# Altium project trusted_io_evt2.PrjPcb (part 1 of 2)
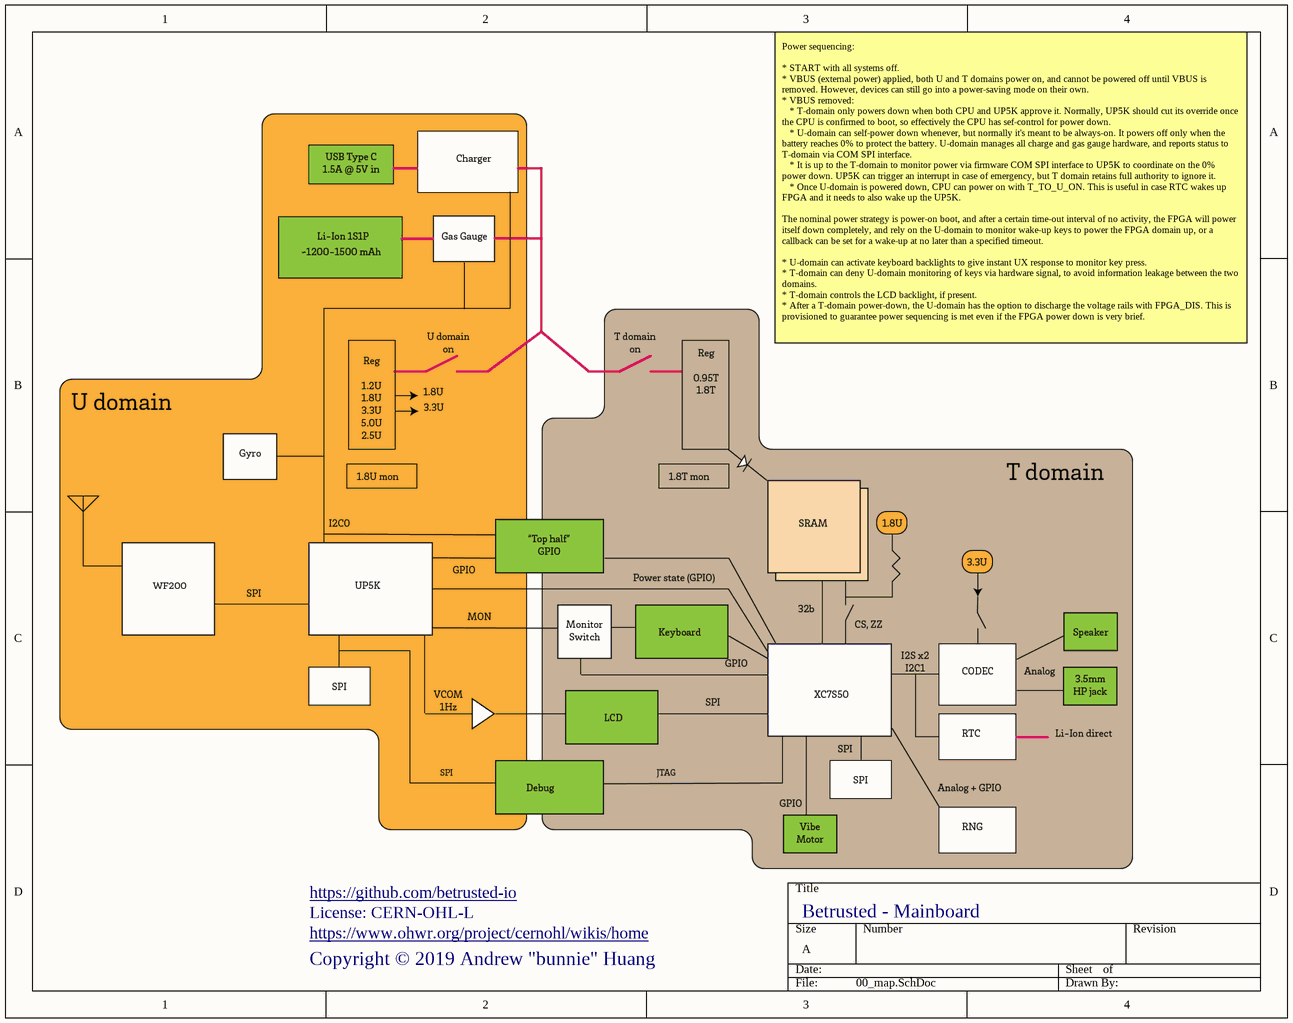
[diagram p0: 00_map.SchDoc]
7 sheets, 359 parts. Net scope: global (net labels, ports and power ports of the same name join across sheets).
Board file: betrusted_evt2b.PcbDoc
Sheets:
  00_map.SchDoc
  01_fpga.SchDoc
  02_memory.SchDoc
  03_power.SchDoc
  04_io.SchDoc
  05_kbd_pm.SchDoc
  07_ux.SchDoc

## Sheet 00_map.SchDoc
size A

### Notes on the sheet
- Power sequencing:
  * START with all systems off.
  * VBUS (external power) applied, both U and T domains power on, and cannot be powered off until VBUS is removed. However, devices can still go into a power-saving mode on their own.
  * VBUS removed:
  * T-domain only powers down when both CPU and UP5K approve it. Normally, UP5K should cut its override once the CPU is confirmed to boot, so effectively the CPU has sef-control for power down.
  * U-domain can self-power down whenever, but normally it's meant to be always-on. It powers off only when the battery reaches 0% to protect the battery. U-domain manages all charge and gas gauge hardware, and reports status to T-domain via COM SPI interface.
  * It is up to the T-domain to monitor power via firmware COM SPI interface to UP5K to coordinate on the 0% power down. UP5K can trigger an interrupt in case of emergency, but T domain retains full authority to ignore it.
  * Once U-domain is powered down, CPU can power on with T_TO_U_ON. This is useful in case RTC wakes up FPGA and it needs to also wake up the UP5K.
  The nominal power strategy is power-on boot, and after a certain time-out interval of no activity, the FPGA will power itself down completely, and rely on the U-domain to monitor wake-up keys to power the FPGA domain up, or a callback can be set for a wake-up at no later than a specified timeout.
  * U-domain can activate keyboard backlights to give instant UX response to monitor key press.
  * T-domain can deny U-domain monitoring of keys via hardware signal, to avoid information leakage between the two domains.
  * T-domain controls the LCD backlight, if present.
  * After a T-domain power-down, the U-domain has the option to discharge the voltage rails with FPGA_DIS. This is provisioned to guarantee power sequencing is met even if the FPGA power down is very brief.
- https://github.com/betrusted-io
- License: CERN-OHL-L
- Copyright © 2019 Andrew "bunnie" Huang
- https://www.ohwr.org/project/cernohl/wikis/home
- Betrusted - Mainboard

## Sheet 01_fpga.SchDoc
size C; VENDOR: TI; MPN: SN74AUC1G66YZPR; MYPN: U-SN74AUC1G66YZPR
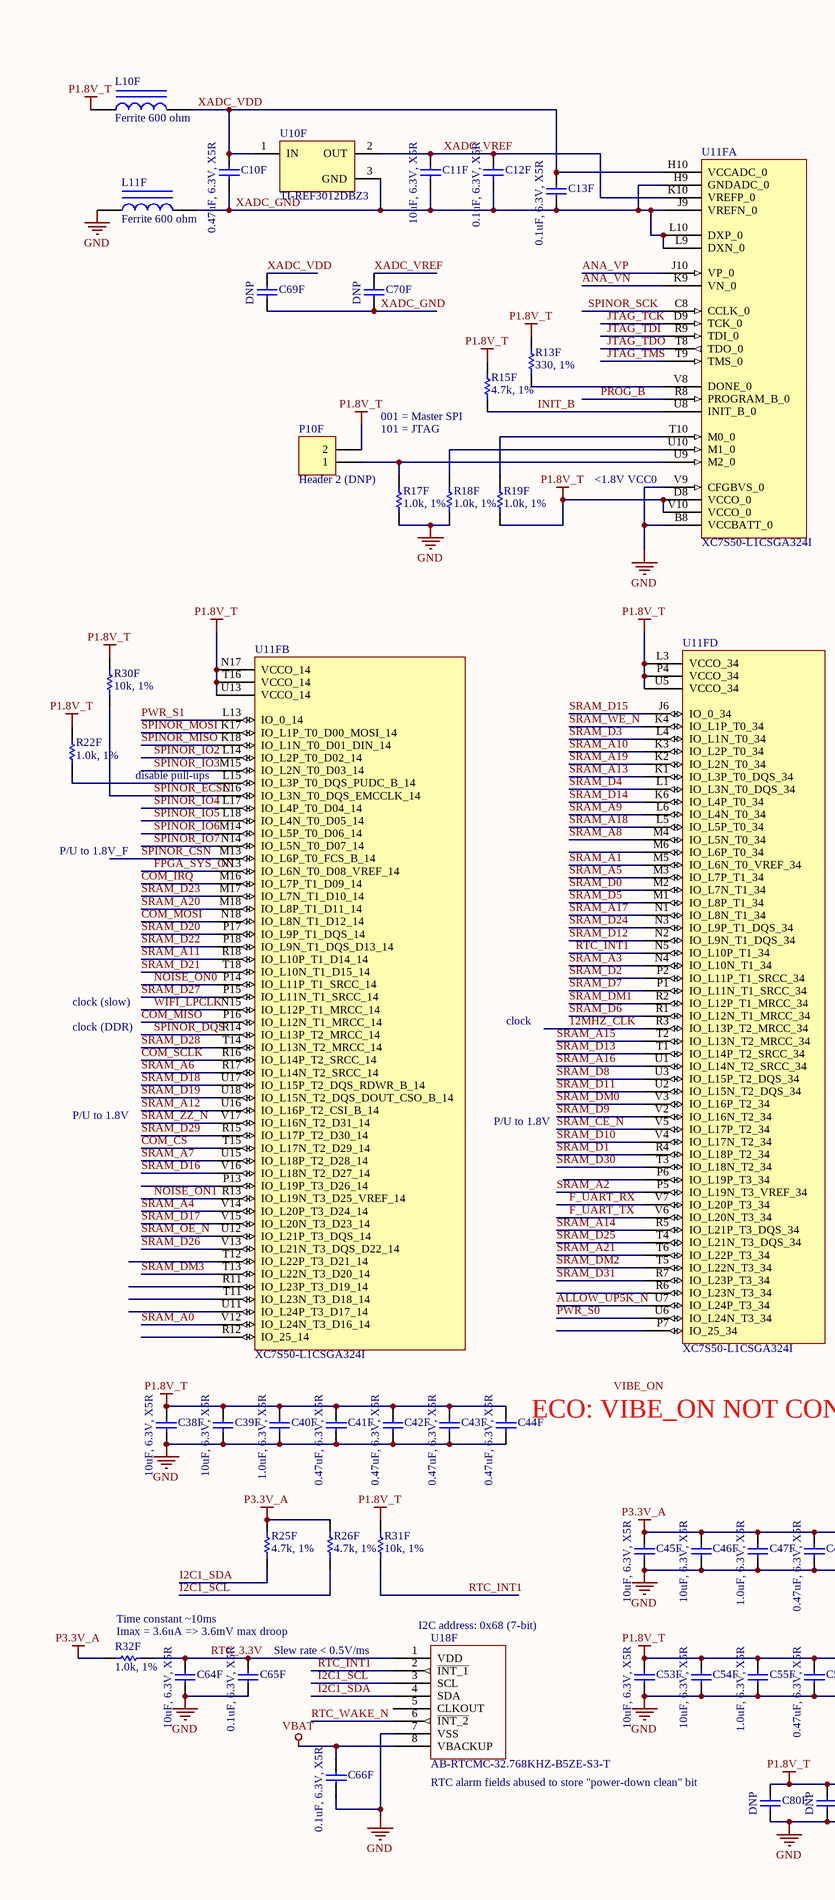
[diagram p1: 01_fpga.SchDoc, left]
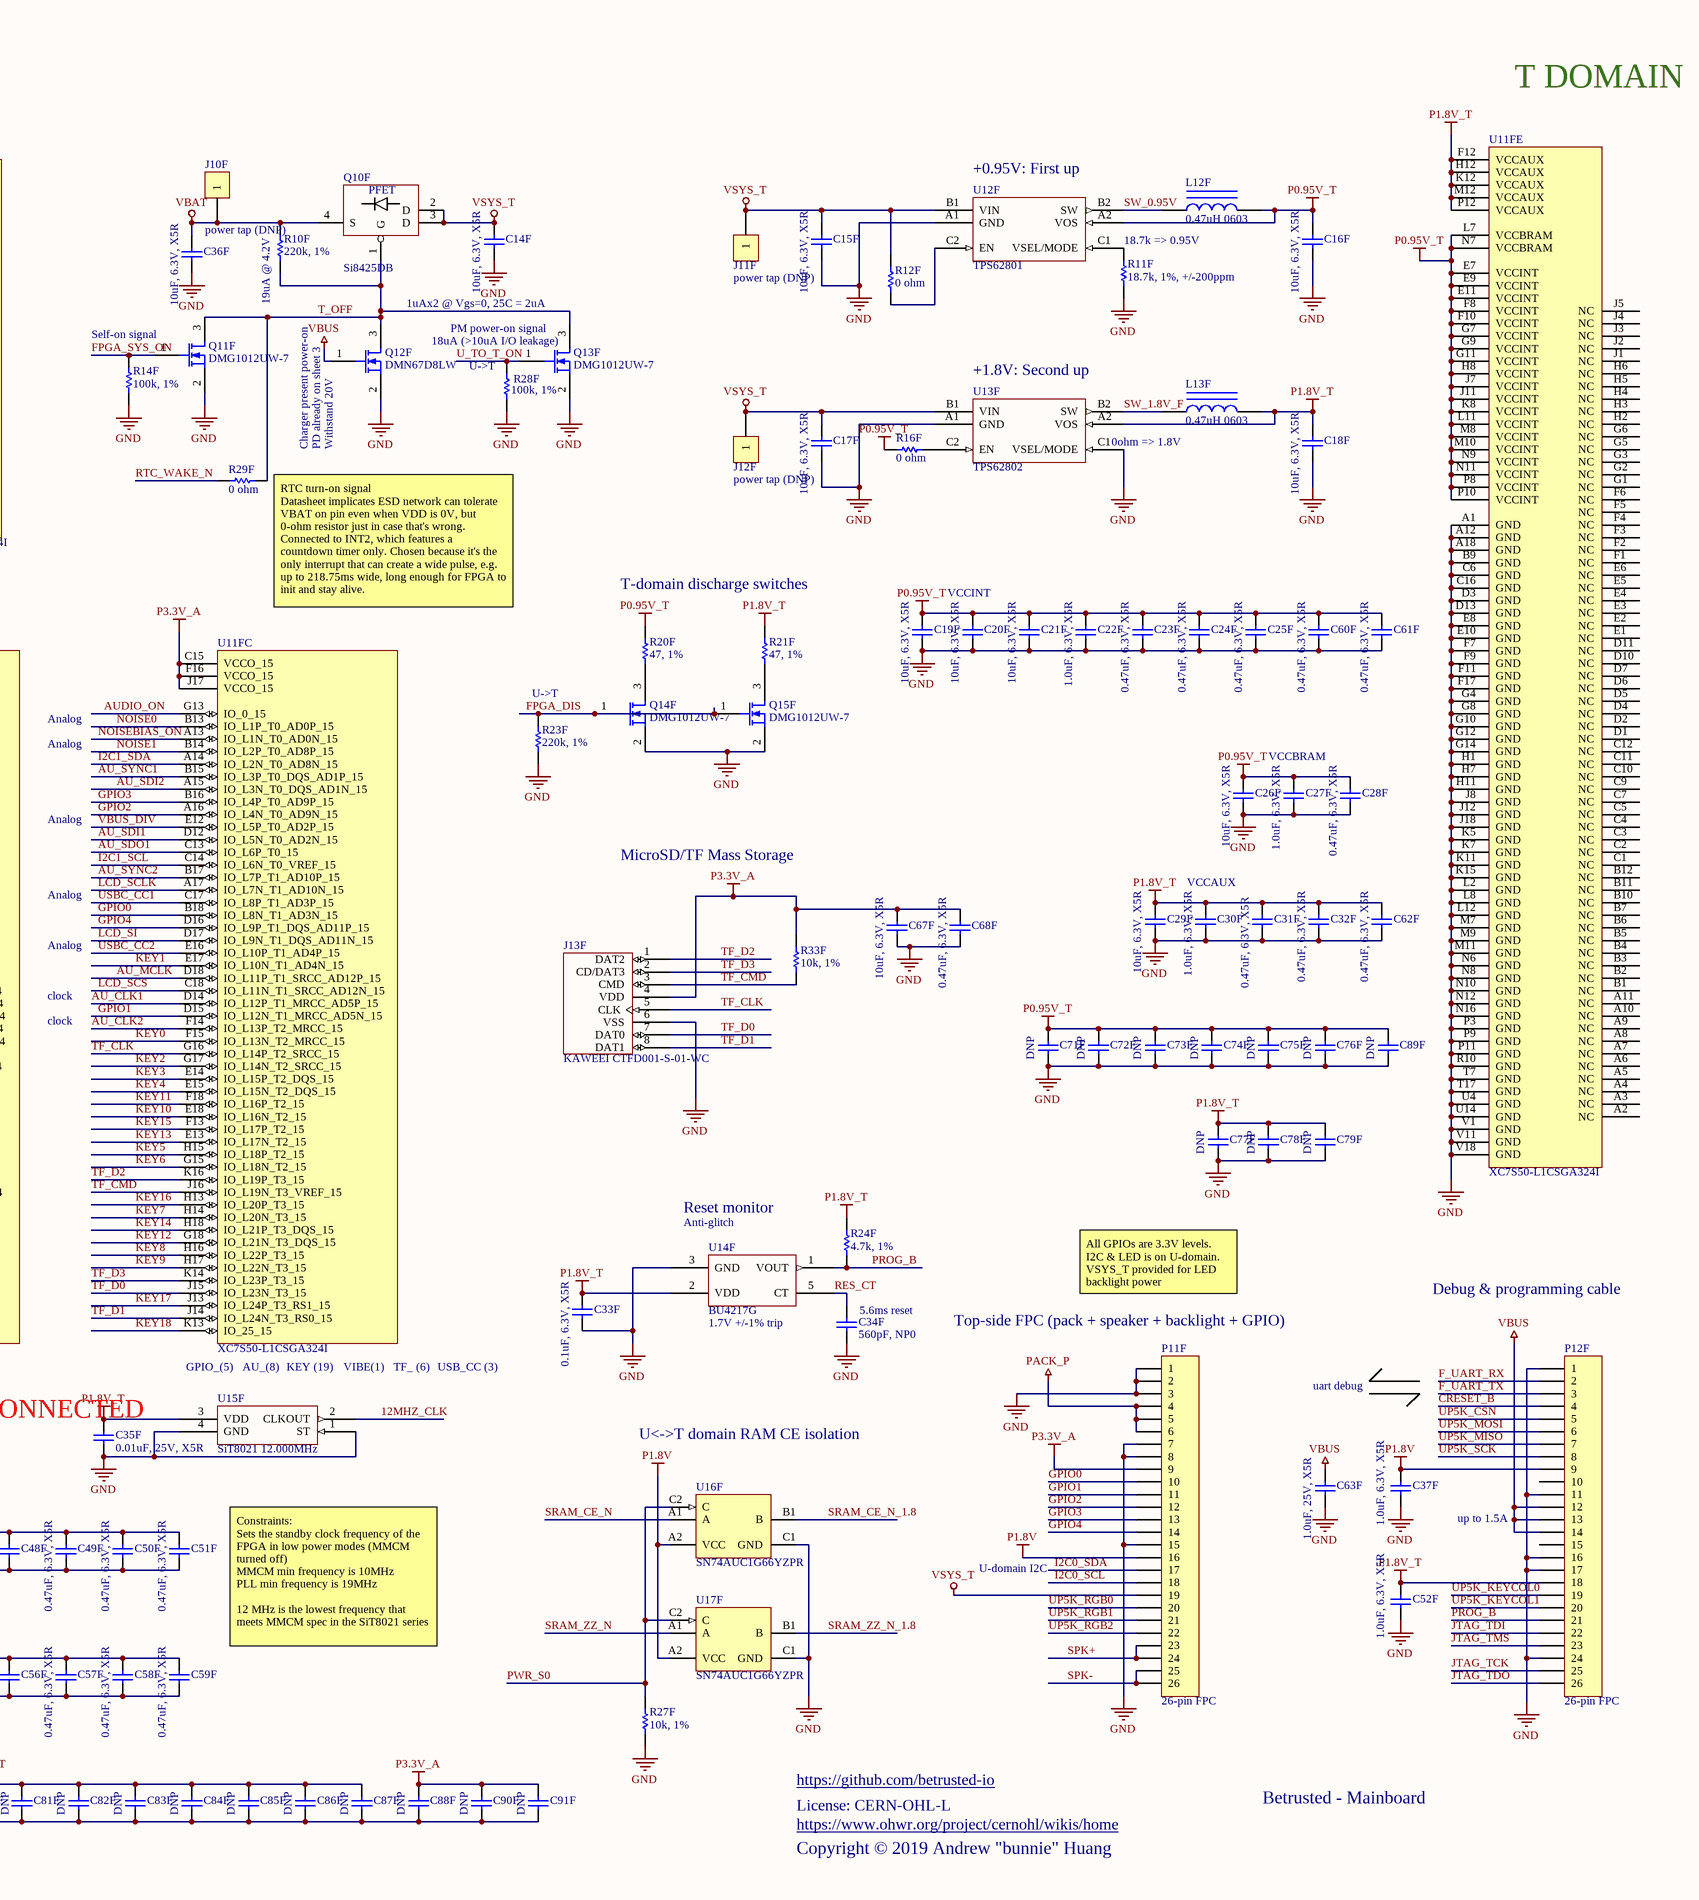
[diagram p2: 01_fpga.SchDoc, right]

### Parts
C10F  0.47uF, 6.3V, X5R  [B_CAP0201]
C11F  10uF, 6.3V, X5R  [B_CAP0603]
C12F  0.1uF, 6.3V, X5R  [B_CAP0201]
C13F  0.1uF, 6.3V, X5R  [B_CAP0201]
C14F  10uF, 6.3V, X5R  [B_CAP0603]
C15F  10uF, 6.3V, X5R  [B_CAP0603]
C16F  10uF, 6.3V, X5R  [B_CAP0603]
C17F  10uF, 6.3V, X5R  [B_CAP0603]
C18F  10uF, 6.3V, X5R  [B_CAP0603]
C19F  10uF, 6.3V, X5R  [B_CAP0603]
C20F  10uF, 6.3V, X5R  [B_CAP0603]
C21F  10uF, 6.3V, X5R  [B_CAP0603]
C22F  1.0uF, 6.3V, X5R  [B_CAP0201]
C23F  0.47uF, 6.3V, X5R  [B_CAP0201]
C24F  0.47uF, 6.3V, X5R  [B_CAP0201]
C25F  0.47uF, 6.3V, X5R  [B_CAP0201]
C26F  10uF, 6.3V, X5R  [B_CAP0603]
C27F  1.0uF, 6.3V, X5R  [B_CAP0201]
C28F  0.47uF, 6.3V, X5R  [B_CAP0201]
C29F  10uF, 6.3V, X5R  [B_CAP0603]
C30F  1.0uF, 6.3V, X5R  [B_CAP0201]
C31F  0.47uF, 6.3V, X5R  [B_CAP0201]
C32F  0.47uF, 6.3V, X5R  [B_CAP0201]
C33F  0.1uF, 6.3V, X5R  [B_CAP0201]
C34F  560pF, NP0  [B_RES0201]
C35F  0.01uF, 25V, X5R  [B_RES0201]
C36F  10uF, 6.3V, X5R  [B_CAP0603]
C37F  1.0uF, 6.3V, X5R  [B_CAP0201]
C38F  10uF, 6.3V, X5R  [B_CAP0603]
C39F  10uF, 6.3V, X5R  [B_CAP0603]
C40F  1.0uF, 6.3V, X5R  [B_CAP0201]
C41F  0.47uF, 6.3V, X5R  [B_CAP0201]
C42F  0.47uF, 6.3V, X5R  [B_CAP0201]
C43F  0.47uF, 6.3V, X5R  [B_CAP0201]
C44F  0.47uF, 6.3V, X5R  [B_CAP0201]
C45F  10uF, 6.3V, X5R  [B_CAP0603]
C46F  10uF, 6.3V, X5R  [B_CAP0603]
C47F  1.0uF, 6.3V, X5R  [B_CAP0201]
C48F  0.47uF, 6.3V, X5R  [B_CAP0201]
C49F  0.47uF, 6.3V, X5R  [B_CAP0201]
C50F  0.47uF, 6.3V, X5R  [B_CAP0201]
C51F  0.47uF, 6.3V, X5R  [B_CAP0201]
C52F  1.0uF, 6.3V, X5R  [B_CAP0201]
C53F  10uF, 6.3V, X5R  [B_CAP0603]
C54F  10uF, 6.3V, X5R  [B_CAP0603]
C55F  1.0uF, 6.3V, X5R  [B_CAP0201]
C56F  0.47uF, 6.3V, X5R  [B_CAP0201]
C57F  0.47uF, 6.3V, X5R  [B_CAP0201]
C58F  0.47uF, 6.3V, X5R  [B_CAP0201]
C59F  0.47uF, 6.3V, X5R  [B_CAP0201]
C60F  0.47uF, 6.3V, X5R  [B_CAP0201]
C61F  0.47uF, 6.3V, X5R  [B_CAP0201]
C62F  0.47uF, 6.3V, X5R  [B_CAP0201]
C63F  1.0uF, 25V, X5R  [B_CAP0603]
C64F  10uF, 6.3V, X5R  [B_CAP0603]
C65F  0.1uF, 6.3V, X5R  [B_CAP0201]
C66F  0.1uF, 6.3V, X5R  [B_CAP0201]
C67F  10uF, 6.3V, X5R  [B_CAP0603]
C68F  0.47uF, 6.3V, X5R  [B_CAP0201]
C69F  DNP  [B_CAP0201]
C70F  DNP  [B_CAP0201]
C71F  DNP  [B_CAP0201]
C72F  DNP  [B_CAP0201]
C73F  DNP  [B_CAP0201]
C74F  DNP  [B_CAP0201]
C75F  DNP  [B_CAP0201]
C76F  DNP  [B_CAP0201]
C77F  DNP  [B_CAP0201]
C78F  DNP  [B_CAP0201]
C79F  DNP  [B_CAP0201]
C80F  DNP  [B_CAP0201]
C81F  DNP  [B_CAP0201]
C82F  DNP  [B_CAP0201]
C83F  DNP  [B_CAP0201]
C84F  DNP  [B_CAP0201]
C85F  DNP  [B_CAP0201]
C86F  DNP  [B_CAP0201]
C87F  DNP  [B_CAP0201]
C88F  DNP  [B_CAP0201]
C89F  DNP  [B_CAP0201]
C90F  DNP  [B_CAP0201]
C91F  DNP  [B_CAP0201]
J10F  power tap (DNP)  [RESTAP-0603]
J11F  power tap (DNP)  [RESTAP-0603]
J12F  power tap (DNP)  [RESTAP-0603]
J13F  KAWEEI CTFD001-S-01-WC  [AUK_TFC08W01-HC-H]
L10F  Ferrite 600 ohm  [B_IND0603]
L11F  Ferrite 600 ohm  [B_IND0603]
L12F  0.47uH 0603  [B_IND0603]
L13F  0.47uH 0603  [B_IND0603]
P10F  Header 2 (DNP)  [HDR1X2]
P11F  26-pin FPC  [HRS_FH34SRJ-26S-0.5SH(50)]
P12F  26-pin FPC  [HRS_FH34SRJ-26S-0.5SH(50)]
Q10F  Si8425DB  [VISHAY_MICRO_FOOT_4_BUMP]
Q11F  DMG1012UW-7  [SOT323-3AN]
Q12F  DMN67D8LW  [SOT323-3AN]
Q13F  DMG1012UW-7  [SOT323-3AN]
Q14F  DMG1012UW-7  [SOT323-3AN]
Q15F  DMG1012UW-7  [SOT323-3AN]
R10F  220k, 1%  [B_RES0201]
R11F  18.7k, 1%, +/-200ppm  [B_RES0402]
R12F  0 ohm  [B_RES0201]
R13F  330, 1%  [B_RES0201]
R14F  100k, 1%  [B_RES0201]
R15F  4.7k, 1%  [B_RES0201]
R16F  0 ohm  [B_RES0201]
R17F  1.0k, 1%  [B_RES0201]
R18F  1.0k, 1%  [B_RES0201]
R19F  1.0k, 1%  [B_RES0201]
R20F  47, 1%  [B_RES0402]
R21F  47, 1%  [B_RES0402]
R22F  1.0k, 1%  [B_RES0201]
R23F  220k, 1%  [B_RES0201]
R24F  4.7k, 1%  [B_RES0201]
R25F  4.7k, 1%  [B_RES0201]
R26F  4.7k, 1%  [B_RES0201]
R27F  10k, 1%  [B_RES0201]
R28F  100k, 1%  [B_RES0201]
R29F  0 ohm  [B_RES0201]
R30F  10k, 1%  [B_RES0201]
R31F  10k, 1%  [B_RES0201]
R32F  1.0k, 1%  [B_RES0201]
R33F  10k, 1%  [B_RES0201]
U10F  TI-REF3012DBZ3  [ONSC-SOT-23-3-318-08_V]
U11F  XC7S50-L1CSGA324I  [BGA324C80P18X18_1500X1500X150]  (parts A,B,C,D,E of 5)
U12F  TPS62801  [BGA6C35P2X3_70X105X40_NSMD]
U13F  TPS62802  [BGA6C35P2X3_70X105X40_NSMD]
U14F  BU4217G  [SOT23-5AN]
U15F  SiT8021 12.000MHz  [SiTIME_CSP]
U16F  SN74AUC1G66YZPR  [YZP0005ADAD]
U17F  SN74AUC1G66YZPR  [YZP0005ADAD]
U18F  AB-RTCMC-32.768KHZ-B5ZE-S3-T  [ABRACON_RTCMC_LGA10]

### Nets
GND: C14F.2 C15F.2 C16F.2 C17F.2 C18F.2 C19F.2 C20F.2 C21F.2 C22F.1 C23F.2 C24F.2 C25F.2 C26F.2 C27F.1 C28F.2 C29F.2 C30F.1 C31F.2 C32F.2 C33F.2 C34F.2 C35F.2 C36F.2 C37F.1 C38F.2 C39F.2 C40F.1 C41F.2 C42F.2 C43F.2 C44F.2 C45F.2 C46F.2 C47F.1 C48F.2 C49F.2 C50F.2 C51F.2 C52F.1 C53F.2 C54F.2 C55F.1 C56F.2 C57F.2 C58F.2 C59F.2 C60F.2 C61F.2 C62F.2 C63F.2 C64F.2 C65F.2 C66F.2 C67F.2 C68F.2 C71F.2 C72F.2 C73F.2 C74F.2 C75F.2 C76F.2 C77F.2 C78F.2 C79F.2 C80F.2 C81F.2 C82F.2 C83F.2 C84F.2 C85F.2 C86F.2 C87F.2 C88F.2 C89F.2 C90F.2 C91F.2 J13F.6(VSS) L11F.1 P11F.1 P11F.2 P11F.3 P11F.7 P11F.8 P11F.15 P12F.1 P12F.11 P12F.16 P12F.17 P12F.24 Q11F.2(S) Q12F.2(S) Q13F.2(S) Q14F.2(S) Q15F.2(S) R11F.2 R14F.1 R17F.1 R18F.1 R23F.1 R27F.2 R28F.1 U11F.A1(GND) U11F.A12(GND) U11F.A18(GND) U11F.B8(VCCBATT_0) U11F.B9(GND) U11F.C6(GND) U11F.C16(GND) U11F.D3(GND) U11F.D13(GND) U11F.E8(GND) U11F.E10(GND) U11F.F7(GND) U11F.F9(GND) U11F.F11(GND) U11F.F17(GND) U11F.G4(GND) U11F.G8(GND) U11F.G10(GND) U11F.G12(GND) U11F.G14(GND) U11F.H1(GND) U11F.H7(GND) U11F.H11(GND) U11F.J8(GND) U11F.J12(GND) U11F.J18(GND) U11F.K5(GND) U11F.K7(GND) U11F.K11(GND) U11F.K15(GND) U11F.L2(GND) U11F.L8(GND) U11F.L12(GND) U11F.M7(GND) U11F.M9(GND) U11F.M11(GND) U11F.N6(GND) U11F.N8(GND) U11F.N10(GND) U11F.N12(GND) U11F.N16(GND) U11F.P3(GND) U11F.P9(GND) U11F.P11(GND) U11F.R10(GND) U11F.T7(GND) U11F.T17(GND) U11F.U4(GND) U11F.U14(GND) U11F.V1(GND) U11F.V9(CFGBVS_0) U11F.V11(GND) U11F.V18(GND) U12F.A1(GND) U13F.A1(GND) U13F.C1(VSEL/MODE) U14F.3(GND) U15F.1(ST) U15F.4(GND) U16F.C1(GND) U17F.C1(GND) U18F.7(VSS)
P0.95V_T: C16F.1 C19F.1 C20F.1 C21F.1 C22F.2 C23F.1 C24F.1 C25F.1 C26F.1 C27F.2 C28F.1 C60F.1 C61F.1 C71F.1 C72F.1 C73F.1 C74F.1 C75F.1 C76F.1 C89F.1 L12F.2 R16F.1 R20F.2 U11F.E7(VCCINT) U11F.E9(VCCINT) U11F.E11(VCCINT) U11F.F8(VCCINT) U11F.F10(VCCINT) U11F.G7(VCCINT) U11F.G9(VCCINT) U11F.G11(VCCINT) U11F.H8(VCCINT) U11F.J7(VCCINT) U11F.J11(VCCINT) U11F.K8(VCCINT) U11F.L7(VCCBRAM) U11F.L11(VCCINT) U11F.M8(VCCINT) U11F.M10(VCCINT) U11F.N7(VCCBRAM) U11F.N9(VCCINT) U11F.N11(VCCINT) U11F.P8(VCCINT) U11F.P10(VCCINT) U12F.A2(VOS)
P1.8V: C37F.2 P11F.16 P12F.9 U16F.A2(VCC) U17F.A2(VCC)
P1.8V_T: C18F.1 C29F.1 C30F.2 C31F.1 C32F.1 C33F.1 C35F.1 C38F.1 C39F.1 C40F.2 C41F.1 C42F.1 C43F.1 C44F.1 C52F.2 C53F.1 C54F.1 C55F.2 C56F.1 C57F.1 C58F.1 C59F.1 C62F.1 C77F.1 C78F.1 C79F.1 C80F.1 C81F.1 C82F.1 C83F.1 C84F.1 C85F.1 C86F.1 C87F.1 L10F.1 L13F.2 P10F.2 P12F.18 R13F.2 R15F.2 R19F.1 R21F.2 R22F.2 R24F.2 R30F.1 R31F.1 U11F.D8(VCCO_0) U11F.F12(VCCAUX) U11F.H12(VCCAUX) U11F.K12(VCCAUX) U11F.L3(VCCO_34) U11F.M12(VCCAUX) U11F.N17(VCCO_14) U11F.P4(VCCO_34) U11F.P12(VCCAUX) U11F.T16(VCCO_14) U11F.U5(VCCO_34) U11F.U13(VCCO_14) U11F.V10(VCCO_0) U13F.A2(VOS) U14F.2(VDD) U15F.3(VDD)
P3.3V_A: C45F.1 C46F.1 C47F.2 C48F.1 C49F.1 C50F.1 C51F.1 C67F.1 C68F.1 C88F.1 C90F.1 C91F.1 J13F.4(VDD) P11F.9 R25F.2 R26F.2 R32F.2 R33F.1 U11F.C15(VCCO_15) U11F.F16(VCCO_15) U11F.J17(VCCO_15)
PACK_P: P11F.4 P11F.5 P11F.6
VBAT: C36F.1 C66F.1 J10F.1 Q10F.4(S) R10F.2 U18F.8(VBACKUP)
VBUS: C63F.1 P12F.12 P12F.13 P12F.14 Q12F.1(G)
VSYS_T: C14F.1 C15F.1 C17F.1 J11F.1 J12F.1 P11F.19 Q10F.2(D) Q10F.3(D) R12F.2 U12F.B1(VIN) U13F.B1(VIN)
12MHZ_CLK: U11F.R3(IO_L13P_T2_MRCC_34) U15F.2(CLKOUT)
ALLOW_UP5K_N: U11F.U7(IO_L24P_T3_34)
ANA_VN: U11F.K9(VN_0)
ANA_VP: U11F.J10(VP_0)
AU_CLK1: U11F.D14(IO_L12P_T1_MRCC_AD5P_15)
AU_CLK2: U11F.F14(IO_L13P_T2_MRCC_15)
AU_MCLK: U11F.D18(IO_L11P_T1_SRCC_AD12P_15)
AU_SDI1: U11F.D12(IO_L5N_T0_AD2N_15)
AU_SDI2: U11F.A15(IO_L3N_T0_DQS_AD1N_15)
AU_SDO1: U11F.C13(IO_L6P_T0_15)
AU_SYNC1: U11F.B15(IO_L3P_T0_DQS_AD1P_15)
AU_SYNC2: U11F.B17(IO_L7P_T1_AD10P_15)
AUDIO_ON: U11F.G13(IO_0_15)
COM_CS: U11F.T15(IO_L17N_T2_D29_14)
COM_IRQ: U11F.M16(IO_L7P_T1_D09_14)
COM_MISO: U11F.P16(IO_L12N_T1_MRCC_14)
COM_MOSI: U11F.N18(IO_L8N_T1_D12_14)
COM_SCLK: U11F.R16(IO_L14P_T2_SRCC_14)
CRESET_B: P12F.4
F_UART_RX: P12F.2 U11F.V7(IO_L20P_T3_34)
F_UART_TX: P12F.3 U11F.V6(IO_L20N_T3_34)
FPGA_DIS: Q14F.1(G) Q15F.1(G) R23F.2
FPGA_SYS_ON: Q11F.1(G) R14F.2 U11F.N13(IO_L6N_T0_D08_VREF_14)
GPIO0: P11F.10 U11F.B18(IO_L8N_T1_AD3N_15)
GPIO1: P11F.11 U11F.D15(IO_L12N_T1_MRCC_AD5N_15)
GPIO2: P11F.12 U11F.A16(IO_L4N_T0_AD9N_15)
GPIO3: P11F.13 U11F.B16(IO_L4P_T0_AD9P_15)
GPIO4: P11F.14 U11F.D16(IO_L9P_T1_DQS_AD11P_15)
I2C0_SCL: P11F.18
I2C0_SDA: P11F.17
I2C1_SCL: R26F.1 U11F.C14(IO_L6N_T0_VREF_15) U18F.3(SCL)
I2C1_SDA: R25F.1 U11F.A14(IO_L2N_T0_AD8N_15) U18F.4(SDA)
INIT_B: R15F.1 U11F.U8(INIT_B_0)
JTAG_TCK: P12F.25 U11F.D9(TCK_0)
JTAG_TDI: P12F.22 U11F.R9(TDI_0)
JTAG_TDO: P12F.26 U11F.T8(TDO_0)
JTAG_TMS: P12F.23 U11F.T9(TMS_0)
KEY0: U11F.F15(IO_L13N_T2_MRCC_15)
KEY1: U11F.E17(IO_L10N_T1_AD4N_15)
KEY2: U11F.G17(IO_L14N_T2_SRCC_15)
KEY3: U11F.E14(IO_L15P_T2_DQS_15)
KEY4: U11F.E15(IO_L15N_T2_DQS_15)
KEY5: U11F.H15(IO_L18P_T2_15)
KEY6: U11F.G15(IO_L18N_T2_15)
KEY7: U11F.H14(IO_L20N_T3_15)
KEY8: U11F.H16(IO_L22P_T3_15)
KEY9: U11F.H17(IO_L22N_T3_15)
KEY10: U11F.E18(IO_L16N_T2_15)
KEY11: U11F.F18(IO_L16P_T2_15)
KEY12: U11F.G18(IO_L21N_T3_DQS_15)
KEY13: U11F.E13(IO_L17N_T2_15)
KEY14: U11F.H18(IO_L21P_T3_DQS_15)
KEY15: U11F.F13(IO_L17P_T2_15)
KEY16: U11F.H13(IO_L20P_T3_15)
KEY17: U11F.J13(IO_L24P_T3_RS1_15)
KEY18: U11F.K13(IO_25_15)
LCD_SCLK: U11F.A17(IO_L7N_T1_AD10N_15)
LCD_SCS: U11F.C18(IO_L11N_T1_SRCC_AD12N_15)
LCD_SI: U11F.D17(IO_L9N_T1_DQS_AD11N_15)
NOISE0: U11F.B13(IO_L1P_T0_AD0P_15)
NOISE1: U11F.B14(IO_L2P_T0_AD8P_15)
NOISE_ON0: U11F.P14(IO_L11P_T1_SRCC_14)
NOISE_ON1: U11F.R13(IO_L19N_T3_D25_VREF_14)
NOISEBIAS_ON: U11F.A13(IO_L1N_T0_AD0N_15)
PROG_B: P12F.21 R24F.1 U11F.R8(PROGRAM_B_0) U14F.1(VOUT)
PWR_S0: R27F.1 U11F.U6(IO_L24N_T3_34) U16F.C2(C) U17F.C2(C)
PWR_S1: U11F.L13(IO_0_14)
RES_CT: C34F.1 U14F.5(CT)
RTC_3.3V: C64F.1 C65F.1 R32F.1 U18F.1(VDD)
RTC_INT1: R31F.2 U11F.N5(IO_L10P_T1_34) U18F.2(~{INT_1})
RTC_WAKE_N: R29F.1 U18F.6(~{INT_2})
SPINOR_CSN: U11F.M13(IO_L6P_T0_FCS_B_14)
SPINOR_DQS: U11F.R14(IO_L13P_T2_MRCC_14)
SPINOR_ECSN: R30F.2 U11F.L16(IO_L3N_T0_DQS_EMCCLK_14)
SPINOR_IO2: U11F.L14(IO_L2P_T0_D02_14)
SPINOR_IO3: U11F.M15(IO_L2N_T0_D03_14)
SPINOR_IO4: U11F.L17(IO_L4P_T0_D04_14)
SPINOR_IO5: U11F.L18(IO_L4N_T0_D05_14)
SPINOR_IO6: U11F.M14(IO_L5P_T0_D06_14)
SPINOR_IO7: U11F.N14(IO_L5N_T0_D07_14)
SPINOR_MISO: U11F.K18(IO_L1N_T0_D01_DIN_14)
SPINOR_MOSI: U11F.K17(IO_L1P_T0_D00_MOSI_14)
SPINOR_SCK: U11F.C8(CCLK_0)
SPK+: P11F.23 P11F.24
SPK-: P11F.25 P11F.26
SRAM_A0: U11F.V12(IO_L24N_T3_D16_14)
SRAM_A1: U11F.M5(IO_L6N_T0_VREF_34)
SRAM_A2: U11F.P5(IO_L19N_T3_VREF_34)
SRAM_A3: U11F.N4(IO_L10N_T1_34)
SRAM_A4: U11F.V14(IO_L20P_T3_D24_14)
SRAM_A5: U11F.M3(IO_L7P_T1_34)
SRAM_A6: U11F.R17(IO_L14N_T2_SRCC_14)
SRAM_A7: U11F.U15(IO_L18P_T2_D28_14)
SRAM_A8: U11F.M4(IO_L5N_T0_34)
SRAM_A9: U11F.L6(IO_L4N_T0_34)
SRAM_A10: U11F.K3(IO_L2P_T0_34)
SRAM_A11: U11F.R18(IO_L10P_T1_D14_14)
SRAM_A12: U11F.U16(IO_L16P_T2_CSI_B_14)
SRAM_A13: U11F.K1(IO_L3P_T0_DQS_34)
SRAM_A14: U11F.R5(IO_L21P_T3_DQS_34)
SRAM_A15: U11F.T2(IO_L13N_T2_MRCC_34)
SRAM_A16: U11F.U1(IO_L14N_T2_SRCC_34)
SRAM_A17: U11F.N1(IO_L8N_T1_34)
SRAM_A18: U11F.L5(IO_L5P_T0_34)
SRAM_A19: U11F.K2(IO_L2N_T0_34)
SRAM_A20: U11F.M18(IO_L8P_T1_D11_14)
SRAM_A21: U11F.T6(IO_L22P_T3_34)
SRAM_CE_N: U11F.V5(IO_L17P_T2_34) U16F.A1(A)
SRAM_CE_N_1.8: U16F.B1(B)
SRAM_D0: U11F.M2(IO_L7N_T1_34)
SRAM_D1: U11F.R4(IO_L18P_T2_34)
SRAM_D2: U11F.P2(IO_L11P_T1_SRCC_34)
SRAM_D3: U11F.L4(IO_L1N_T0_34)
SRAM_D4: U11F.L1(IO_L3N_T0_DQS_34)
SRAM_D5: U11F.M1(IO_L8P_T1_34)
SRAM_D6: U11F.R1(IO_L12N_T1_MRCC_34)
SRAM_D7: U11F.P1(IO_L11N_T1_SRCC_34)
SRAM_D8: U11F.U3(IO_L15P_T2_DQS_34)
SRAM_D9: U11F.V2(IO_L16N_T2_34)
SRAM_D10: U11F.V4(IO_L17N_T2_34)
SRAM_D11: U11F.U2(IO_L15N_T2_DQS_34)
SRAM_D12: U11F.N2(IO_L9N_T1_DQS_34)
SRAM_D13: U11F.T1(IO_L14P_T2_SRCC_34)
SRAM_D14: U11F.K6(IO_L4P_T0_34)
SRAM_D15: U11F.J6(IO_0_34)
SRAM_D16: U11F.V16(IO_L18N_T2_D27_14)
SRAM_D17: U11F.V15(IO_L20N_T3_D23_14)
SRAM_D18: U11F.U17(IO_L15P_T2_DQS_RDWR_B_14)
SRAM_D19: U11F.U18(IO_L15N_T2_DQS_DOUT_CSO_B_14)
SRAM_D20: U11F.P17(IO_L9P_T1_DQS_14)
SRAM_D21: U11F.T18(IO_L10N_T1_D15_14)
SRAM_D22: U11F.P18(IO_L9N_T1_DQS_D13_14)
SRAM_D23: U11F.M17(IO_L7N_T1_D10_14)
SRAM_D24: U11F.N3(IO_L9P_T1_DQS_34)
SRAM_D25: U11F.T4(IO_L21N_T3_DQS_34)
SRAM_D26: U11F.V13(IO_L21N_T3_DQS_D22_14)
SRAM_D27: U11F.P15(IO_L11N_T1_SRCC_14)
SRAM_D28: U11F.T14(IO_L13N_T2_MRCC_14)
SRAM_D29: U11F.R15(IO_L17P_T2_D30_14)
SRAM_D30: U11F.T3(IO_L18N_T2_34)
SRAM_D31: U11F.R7(IO_L23P_T3_34)
SRAM_DM0: U11F.V3(IO_L16P_T2_34)
SRAM_DM1: U11F.R2(IO_L12P_T1_MRCC_34)
SRAM_DM2: U11F.T5(IO_L22N_T3_34)
SRAM_DM3: U11F.T13(IO_L22N_T3_D20_14)
SRAM_OE_N: U11F.U12(IO_L21P_T3_DQS_14)
SRAM_WE_N: U11F.K4(IO_L1P_T0_34)
SRAM_ZZ_N: U11F.V17(IO_L16N_T2_D31_14) U17F.A1(A)
SRAM_ZZ_N_1.8: U17F.B1(B)
SW_0.95V: L12F.1 U12F.B2(SW)
SW_1.8V_F: L13F.1 U13F.B2(SW)
T_OFF: Q10F.1(G) Q11F.3(D) Q12F.3(D) Q13F.3(D) R10F.1 R29F.2
TF_CLK: J13F.5(CLK) U11F.G16(IO_L14P_T2_SRCC_15)
TF_CMD: J13F.3(CMD) R33F.2 U11F.J16(IO_L19N_T3_VREF_15)
TF_D0: J13F.7(DAT0) U11F.J15(IO_L23N_T3_15)
TF_D1: J13F.8(DAT1) U11F.J14(IO_L24N_T3_RS0_15)
TF_D2: J13F.1(DAT2) U11F.K16(IO_L19P_T3_15)
TF_D3: J13F.2(CD/DAT3) U11F.K14(IO_L23P_T3_15)
U_TO_T_ON: Q13F.1(G) R28F.2
UP5K_CSN: P12F.5
UP5K_KEYCOL0: P12F.19
UP5K_KEYCOL1: P12F.20
UP5K_MISO: P12F.7
UP5K_MOSI: P12F.6
UP5K_RGB0: P11F.20
UP5K_RGB1: P11F.21
UP5K_RGB2: P11F.22
UP5K_SCK: P12F.8
USBC_CC1: U11F.C17(IO_L8P_T1_AD3P_15)
USBC_CC2: U11F.E16(IO_L10P_T1_AD4P_15)
VBUS_DIV: U11F.E12(IO_L5P_T0_AD2P_15)
WIFI_LPCLK: U11F.N15(IO_L12P_T1_MRCC_14)
XADC_GND: C10F.2 C11F.2 C12F.2 C13F.2 C69F.2 C70F.2 L11F.2 U10F.3(GND) U11F.H9(GNDADC_0) U11F.J9(VREFN_0) U11F.L9(DXN_0) U11F.L10(DXP_0)
XADC_VDD: C10F.1 C13F.1 C69F.1 L10F.2 U10F.1(IN) U11F.H10(VCCADC_0)
XADC_VREF: C11F.1 C12F.1 C70F.1 U10F.2(OUT) U11F.K10(VREFP_0)
NetP10F_1: P10F.1 R17F.2 U11F.U9(M2_0)
NetQ14F_3: Q14F.3(D) R20F.1
NetQ15F_3: Q15F.3(D) R21F.1
NetR11F_1: R11F.1 U12F.C1(VSEL/MODE)
NetR12F_1: R12F.1 U12F.C2(EN)
NetR13F_1: R13F.1 U11F.V8(DONE_0)
NetR16F_2: R16F.2 U13F.C2(EN)
NetR18F_2: R18F.2 U11F.U10(M1_0)
NetR19F_2: R19F.2 U11F.T10(M0_0)
NetR22F_1: R22F.1 U11F.L15(IO_L3P_T0_DQS_PUDC_B_14)

Not connected (* = marked no-connect by the designer): P12F 10 15; U11F A2(NC) A3(NC) A4(NC) A5(NC) A6(NC) A7(NC) A8(NC) A9(NC) A10(NC) A11(NC) B1(NC) B2(NC) B3(NC) B4(NC) B5(NC) B6(NC) B7(NC) B10(NC) B11(NC) B12(NC) C1(NC) C2(NC) C3(NC) C4(NC) C5(NC) C7(NC) C9(NC) C10(NC) C11(NC) C12(NC) D1(NC) D2(NC) D4(NC) D5(NC) D6(NC) D7(NC) D10(NC) D11(NC) E1(NC) E2(NC) E3(NC) E4(NC) E5(NC) E6(NC) F1(NC) F2(NC) F3(NC) F4(NC) F5(NC) F6(NC) G1(NC) G2(NC) G3(NC) G5(NC) G6(NC) H2(NC) H3(NC) H4(NC) H5(NC) H6(NC) J1(NC) J2(NC) J3(NC) J4(NC) J5(NC) M6(IO_L6P_T0_34) P6(IO_L19P_T3_34) P7(IO_25_34) P13(IO_L19P_T3_D26_14) R6(IO_L23N_T3_34) R11(IO_L23P_T3_D19_14) R12(IO_25_14) T11(IO_L23N_T3_D18_14) T12(IO_L22P_T3_D21_14) U11(IO_L24P_T3_D17_14); U18F 5(CLKOUT)

### Notes on the sheet
- T DOMAIN
- (near U12F) +0.95V: First up
- (near R10F) 19uA @ 4.2V
- (near R11F) 18.7k => 0.95V
- (near Q11F) Self-on signal
- 1uAx2 @ Vgs=0, 25C = 2uA
- (near Q13F) 18uA (>10uA I/O leakage)
- (near Q13F) PM power-on signal
- (near R15F) 001 = Master SPI
- (near R28F) U->T
- (near U13F) +1.8V: Second up
- 101 = JTAG
- <1.8V VCC0
- Charger present power-on
- (near Q12F) PD already on sheet 3
- (near Q12F) Withstand 20V
- 0ohm => 1.8V
- (near R29F) RTC turn-on signal
  Datasheet implicates ESD network can tolerate VBAT on pin even when VDD is 0V, but 0-ohm resistor just in case that's wrong.
  Connected to INT2, which features a countdown timer only. Chosen because it's the only interrupt that can create a wide pulse, e.g. up to 218.75ms wide, long enough for FPGA to init and stay alive.
- T-domain discharge switches
- VCCINT
- Analog
- (near R23F) U->T
- (near U11F) disable pull-ups
- VCCBRAM
- P/U to 1.8V_F
- MicroSD/TF Mass Storage
- VCCAUX
- clock (DDR)
- clock (slow)
- clock
- P/U to 1.8V
- Reset monitor
- (near U14F) Anti-glitch
- All GPIOs are 3.3V levels.
  I2C & LED is on U-domain.
  VSYS_T provided for LED backlight power
- Debug & programming cable
- (near U14F) 1.7V +/-1% trip
- (near C34F) 5.6ms reset
- (near P11F) Top-side FPC (pack + speaker + backlight + GPIO)
- ECO: VIBE_ON NOT CONNECTED
- GPIO_(5)
- AU_(8)
- (near U15F) KEY (19)
- VIBE(1)
- TF_ (6)
- USB_CC (3)
- uart debug
- U<->T domain RAM CE isolation
- up to 1.5A
- U-domain I2C
- Imax = 3.6uA => 3.6mV max droop
- Time constant ~10ms
- (near C65F) Slew rate < 0.5V/ms
- (near U18F) I2C address: 0x68 (7-bit)
- Constraints:
  Sets the standby clock frequency of the FPGA in low power modes (MMCM turned off)
  MMCM min frequency is 10MHz
  PLL min frequency is 19MHz
  12 MHz is the lowest frequency that meets MMCM spec in the SiT8021 series
- RTC alarm fields abused to store "power-down clean" bit
- License: CERN-OHL-L
- https://github.com/betrusted-io
- Betrusted - Mainboard
- Copyright © 2019 Andrew "bunnie" Huang
- https://www.ohwr.org/project/cernohl/wikis/home
- Labels drawn without touching a wire or pin: VIBE_ON
- (in symbol Si8425DB) PFET

### Library data of the parts
C10F C23F C24F C25F C28F C31F C32F C41F C42F C43F C44F C48F C49F C50F C51F C56F C57F C58F C59F C60F C61F C62F C68F = Cap Semi: Capacitor (Semiconductor SIM Model); MPN: CL03A474KQ3NNNH; VENDOR: Samsung; MYPN: C-474-6p3-X5R-0201
C11F C14F C15F C16F C17F C18F C19F C20F C21F C26F C29F C36F C38F C39F C45F C46F C53F C54F C64F C67F = Cap Semi: Capacitor (Semiconductor SIM Model); MPN: CL10A106MQ8NNNC; VENDOR: Samsung; MYPN: C-106-6.3-X5R-0603
C12F C13F C33F C65F C66F = Cap Semi: Capacitor (Semiconductor SIM Model); MPN: CL03A104KQ3NNNC; VENDOR: Samsung; MYPN: C-104-6p3-X5R-0201
C22F C27F C30F C37F C40F C47F C52F C55F = Cap Semi: Capacitor (Semiconductor SIM Model); MPN: GRM033R60J105MEA2D; VENDOR: Murata; MYPN: C-105-6p3-X5R-0201
C34F = Cap Semi: Capacitor (Semiconductor SIM Model); MPN: GRM0335C1E561JA01D; VENDOR: Murata; MYPN: C-561-25-NP0-0201
C35F = Cap Semi: Capacitor (Semiconductor SIM Model); MPN: GRM033R61E103KA12D; VENDOR: Murata; MYPN: C-103-25-X5R-0201
C63F = Cap Semi: Capacitor (Semiconductor SIM Model); MPN: CL10A105KA8NNNC; VENDOR: Samsung; MYPN: C-105-25-X5R-0603
C69F C70F C71F C72F C73F C74F C75F C76F C77F C78F C79F C80F C81F C82F C83F C84F C85F C86F C87F C88F C89F C90F C91F = Cap Semi: Capacitor (Semiconductor SIM Model); MYPN: BOT_DUMMY; MPN: DNP; VENDOR: DNP
J10F J11F J12F = CON1: Connector; MYPN: J-TP-PWRTAP-0603; MPN: DNP; VENDOR: DNP
J13F = MICRO_SD: Captive Micro-SD card for firmware images; MPN: 0472192001; VENDOR: Molex; MYPN: J-MICROSD-SLIDELOCK
L10F L11F = Inductor Iron: Magnetic-Core Inductor; MPN: BLM18AG601SN1D; VENDOR: Murata; MYPN: L-BLM18AG601SN1D
L12F L13F = Inductor Iron: Magnetic-Core Inductor; MPN: TFM160808ALC-R47MTAA; VENDOR: TDK; MYPN: L-TFM160808ALC-R47MTAA
P10F = Header 2: Header, 2-Pin, 2.54mm; LatestRevisionDate: 17-Jul-2002; LatestRevisionNote: Re-released for DXP Platform.; Publisher: Altium Limited; MPN: DNP; MYPN: DNP; VENDOR: DNP
P11F = FPC-26: 26 Pin FPC header; MPN: FH34SRJ-26S-0.5SH(99); MYPN: J-FPC-0.5mm-26-0.3mm-T/B; VENDOR: Hirose; System: Connector
P12F = FPC-26: 26 Pin FPC header; MPN: FH34SRJ-26S-0.5SH(99); MYPN: J-FPC-0.5mm-26-0.3mm-T/B; VENDOR: Hirose
Q10F = Si8425DB: P-channel 20V 6.2A 27mOhm @ -2.5V; MPN: SI8457DB-T1-E1; VENDOR: Vishay Siliconix; MYPN: Q-Si8457
Q11F Q13F Q14F Q15F = MOSFET-N: N-Channel MOSFET; VENDOR: Diodes Inc; MYPN: Q-DMG1012UW-7; Published: 8-Jun-2000; LatestRevisionDate: 17-Jul-2002; LatestRevisionNote: Re-released for DXP Platform.; PackageVersion: 1995/1996; PackageReference: E3; Publisher: Altium Limited; MPN: DMG1012UW-7
Q12F = MOSFET-N: N-Channel MOSFET; VENDOR: Diodes Inc; MYPN: Q-DMN67D8LW; Published: 8-Jun-2000; LatestRevisionDate: 17-Jul-2002; LatestRevisionNote: Re-released for DXP Platform.; PackageVersion: 1995/1996; PackageReference: E3; Publisher: Altium Limited; MPN: DMN67D8LW
R10F R23F = Res1: Resistor; VENDOR: ANY; MYPN: R-224-1P-1_16W-0201; MPN: ANY
R11F = Res1: Resistor; MPN: RC0402FR-0718K7L; VENDOR: Yageo; MYPN: R-1872-1P-1_16W-0402
R12F R16F R29F = Res1: Resistor; VENDOR: ANY; MYPN: R-0R0-1P-1_16W-0201; MPN: ANY
R13F = Res1: Resistor; VENDOR: ANY; MYPN: R-331-1P-1_16W-0201; MPN: ANY
R14F R28F = Res1: Resistor; VENDOR: ANY; MYPN: R-104-1P-1_16W-0201; MPN: ANY
R15F R24F R25F R26F = Res1: Resistor; VENDOR: ANY; MYPN: R-472-1P-1_16W-0201; MPN: ANY
R17F R18F R19F R22F R32F = Res1: Resistor; VENDOR: ANY; MYPN: R-102-1P-1_16W-0201; MPN: ANY
R20F R21F = Res1: Resistor; VENDOR: ANY; MYPN: R-470-1P-1_16W-0402; MPN: ANY
R27F R30F R31F R33F = Res1: Resistor; VENDOR: ANY; MYPN: R-103-1P-1_16W-0201; MPN: ANY
U10F = TI-REF3012DBZ3: MPN: REF3012AIDBZT; VENDOR: TI; MYPN: U-REF3012AIDBZR(T/R)
U11F = XC7S25CSGA324: Spartan 7 FPGA in CSGA324 package; VENDOR: XILINX; MYPN: U-XC7S50-CSGA324; MPN: XC7S50-L1CSGA324I
U12F = TPS62801: Buck regulator, 4MHz, 0.6A, 0.8V-1.55V, low Iq; MPN: TPS62801YKAT; VENDOR: TI; MYPN: U-TPS62801YKA(T/R)
U13F = TPS62802: Buck regulator, 4MHz, 0.6A, 1.8V-3.3V, low Iq; MPN: TPS62802YKAR; VENDOR: TI; MYPN: U-TPS62802YKA(T/R)
U14F = BU42XXG: Low voltage free delay time setting CMOS voltage detector IC; MPN: BU4217G-TR; MYPN: U-BU4217G-TR; VENDOR: Rohm
U15F = SiT8021: 1 to 26 MHz micropower oscillator; MPN: SIT8021AI-J4-18S-12.000000E; VENDOR: SiTime; MYPN: U-SIT8021AI-J4-18S-12.000000E
U16F U17F = CMP-0859-01029-3: Single Bilateral Analog Switch, YZP0005ADAD, LARGE T&R; Manufacturer: Texas Instruments; ICC @ Nom Voltage(Max)(mA): 0.01; Bits(#): 1; Input Type: CMOS; VCC(Max)(V): 2.7; Rating: Catalog; Schmitt Trigger: No; Logic: True; tpd @ Nom Voltage(Max)(ns): 0.9,0.3,0.2,0.1; Technology Family: AUC; Output Drive (IOL/IOH)(Max)(mA): 9/-9; Voltage(Nom)(V): 0.8,1.2,1.5,1.8,2.5; VCC(Min)(V): 0.8; Switch Configuration: SPST; F @ Nom Voltage(Max)(Mhz): 250; Output Type: CMOS; PackageReference: YZP0005ADAD; DatasheetVersion: SCES386L; Sub-Family: Analog Switch; Operating Temperature Range(C): -40 to 85; Channels(#): 1; 3-State Output: No; Generic Part Number: SN74AUC1G66
U18F = AB-RTCMC-32.768kHZ-B5ZE-S3: RTC Module with I2C Bus; MYPN: U-AB-RTCMC-32.768KHZ-B5ZE-S3-T; VENDOR: Abracon; MPN: AB-RTCMC-32.768KHZ-B5ZE-S3-T

## Sheet 02_memory.SchDoc
size A
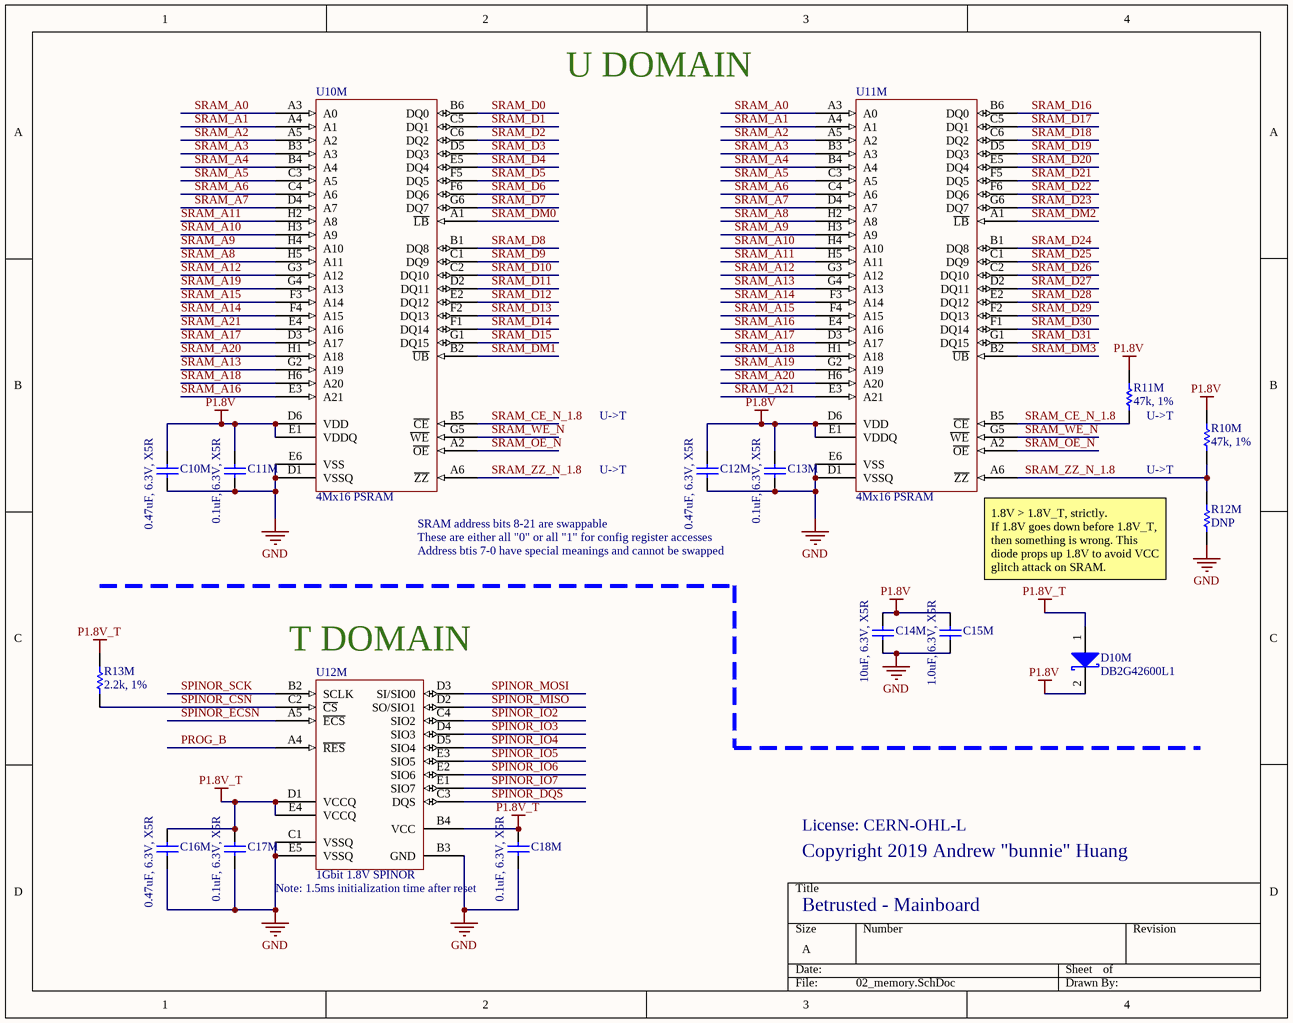
[diagram p3: 02_memory.SchDoc]

### Parts
C10M  0.47uF, 6.3V, X5R  [B_CAP0201]
C11M  0.1uF, 6.3V, X5R  [B_CAP0201]
C12M  0.47uF, 6.3V, X5R  [B_CAP0201]
C13M  0.1uF, 6.3V, X5R  [B_CAP0201]
C14M  10uF, 6.3V, X5R  [B_CAP0603]
C15M  1.0uF, 6.3V, X5R  [B_CAP0201]
C16M  0.47uF, 6.3V, X5R  [B_CAP0201]
C17M  0.1uF, 6.3V, X5R  [B_CAP0201]
C18M  0.1uF, 6.3V, X5R  [B_CAP0201]
D10M  DB2G42600L1  [B_DIO0402]
R10M  47k, 1%  [B_RES0201]
R11M  47k, 1%  [B_RES0201]
R12M  DNP  [B_RES0201]
R13M  2.2k, 1%  [B_RES0201]
U10M  4Mx16 PSRAM  [BGA48C75P6X8_600X800X120]
U11M  4Mx16 PSRAM  [BGA48C75P6X8_600X800X120]
U12M  1Gbit 1.8V SPINOR  [BGA24C100P5X5_600X800X120]

### Nets
GND: C10M.2 C11M.2 C12M.2 C13M.2 C14M.2 C15M.1 C16M.2 C17M.2 C18M.2 R12M.2 U10M.D1(VSSQ) U10M.E6(VSS) U11M.D1(VSSQ) U11M.E6(VSS) U12M.B3(GND) U12M.C1(VSSQ) U12M.E5(VSSQ)
P1.8V: C10M.1 C11M.1 C12M.1 C13M.1 C14M.1 C15M.2 D10M.2(K) R10M.1 R11M.1 U10M.D6(VDD) U10M.E1(VDDQ) U11M.D6(VDD) U11M.E1(VDDQ)
P1.8V_T: C16M.1 C17M.1 C18M.1 D10M.1(A) R13M.2 U12M.B4(VCC) U12M.D1(VCCQ) U12M.E4(VCCQ)
PROG_B: U12M.A4(~{RES})
SPINOR_CSN: R13M.1 U12M.C2(~{CS})
SPINOR_DQS: U12M.C3(DQS)
SPINOR_ECSN: U12M.A5(~{ECS})
SPINOR_IO2: U12M.C4(SIO2)
SPINOR_IO3: U12M.D4(SIO3)
SPINOR_IO4: U12M.D5(SIO4)
SPINOR_IO5: U12M.E3(SIO5)
SPINOR_IO6: U12M.E2(SIO6)
SPINOR_IO7: U12M.E1(SIO7)
SPINOR_MISO: U12M.D2(SO/SIO1)
SPINOR_MOSI: U12M.D3(SI/SIO0)
SPINOR_SCK: U12M.B2(SCLK)
SRAM_A0: U10M.A3(A0) U11M.A3(A0)
SRAM_A1: U10M.A4(A1) U11M.A4(A1)
SRAM_A2: U10M.A5(A2) U11M.A5(A2)
SRAM_A3: U10M.B3(A3) U11M.B3(A3)
SRAM_A4: U10M.B4(A4) U11M.B4(A4)
SRAM_A5: U10M.C3(A5) U11M.C3(A5)
SRAM_A6: U10M.C4(A6) U11M.C4(A6)
SRAM_A7: U10M.D4(A7) U11M.D4(A7)
SRAM_A8: U10M.H5(A11) U11M.H2(A8)
SRAM_A9: U10M.H4(A10) U11M.H3(A9)
SRAM_A10: U10M.H3(A9) U11M.H4(A10)
SRAM_A11: U10M.H2(A8) U11M.H5(A11)
SRAM_A12: U10M.G3(A12) U11M.G3(A12)
SRAM_A13: U10M.G2(A19) U11M.G4(A13)
SRAM_A14: U10M.F4(A15) U11M.F3(A14)
SRAM_A15: U10M.F3(A14) U11M.F4(A15)
SRAM_A16: U10M.E3(A21) U11M.E4(A16)
SRAM_A17: U10M.D3(A17) U11M.D3(A17)
SRAM_A18: U10M.H6(A20) U11M.H1(A18)
SRAM_A19: U10M.G4(A13) U11M.G2(A19)
SRAM_A20: U10M.H1(A18) U11M.H6(A20)
SRAM_A21: U10M.E4(A16) U11M.E3(A21)
SRAM_CE_N_1.8: R11M.2 U10M.B5(~{CE}) U11M.B5(~{CE})
SRAM_D0: U10M.B6(DQ0)
SRAM_D1: U10M.C5(DQ1)
SRAM_D2: U10M.C6(DQ2)
SRAM_D3: U10M.D5(DQ3)
SRAM_D4: U10M.E5(DQ4)
SRAM_D5: U10M.F5(DQ5)
SRAM_D6: U10M.F6(DQ6)
SRAM_D7: U10M.G6(DQ7)
SRAM_D8: U10M.B1(DQ8)
SRAM_D9: U10M.C1(DQ9)
SRAM_D10: U10M.C2(DQ10)
SRAM_D11: U10M.D2(DQ11)
SRAM_D12: U10M.E2(DQ12)
SRAM_D13: U10M.F2(DQ13)
SRAM_D14: U10M.F1(DQ14)
SRAM_D15: U10M.G1(DQ15)
SRAM_D16: U11M.B6(DQ0)
SRAM_D17: U11M.C5(DQ1)
SRAM_D18: U11M.C6(DQ2)
SRAM_D19: U11M.D5(DQ3)
SRAM_D20: U11M.E5(DQ4)
SRAM_D21: U11M.F5(DQ5)
SRAM_D22: U11M.F6(DQ6)
SRAM_D23: U11M.G6(DQ7)
SRAM_D24: U11M.B1(DQ8)
SRAM_D25: U11M.C1(DQ9)
SRAM_D26: U11M.C2(DQ10)
SRAM_D27: U11M.D2(DQ11)
SRAM_D28: U11M.E2(DQ12)
SRAM_D29: U11M.F2(DQ13)
SRAM_D30: U11M.F1(DQ14)
SRAM_D31: U11M.G1(DQ15)
SRAM_DM0: U10M.A1(~{LB})
SRAM_DM1: U10M.B2(~{UB})
SRAM_DM2: U11M.A1(~{LB})
SRAM_DM3: U11M.B2(~{UB})
SRAM_OE_N: U10M.A2(~{OE}) U11M.A2(~{OE})
SRAM_WE_N: U10M.G5(~{WE}) U11M.G5(~{WE})
SRAM_ZZ_N_1.8: R10M.2 R12M.1 U10M.A6(~{ZZ}) U11M.A6(~{ZZ})

### Notes on the sheet
- U DOMAIN
- U->T
- (near R11M) U->T
- (near U10M) SRAM address bits 8-21 are swappable
- These are either all "0" or all "1" for config register accesses
- Address btis 7-0 have special meanings and cannot be swapped
- (near U11M) 1.8V > 1.8V_T, strictly.
  If 1.8V goes down before 1.8V_T, then something is wrong. This diode props up 1.8V to avoid VCC glitch attack on SRAM.
- (near U12M) T DOMAIN
- License: CERN-OHL-L
- Note: 1.5ms initialization time after reset
- Copyright 2019 Andrew "bunnie" Huang
- Betrusted - Mainboard

### Library data of the parts
C10M C12M C16M = Cap Semi: as C10F on sheet 01_fpga
C11M C13M C17M C18M = Cap Semi: as C12F on sheet 01_fpga
C14M = Cap Semi: as C11F on sheet 01_fpga
C15M = Cap Semi: as C22F on sheet 01_fpga
D10M = Diode 11DQ03: Schottky Rectifier; MYPN: D-SCHOTTKY-0402-CSP; VENDOR: Panasonic; ComponentLink1Description: Manufacturer Link; ComponentLink1URL: http://www.irf.com/; ComponentLink2Description: Datasheet; ComponentLink2URL: http://www.irf.com/product-info/datasheets/data/11dq03.pdf; MPN: DB2G42600L1
R10M R11M = Res1: Resistor; VENDOR: ANY; MYPN: R-473-1P-1_16W-0201; MPN: ANY
R12M = Res1: Resistor; VENDOR: ANY; MYPN: DNP; MPN: ANY
R13M = Res1: Resistor; VENDOR: ANY; MYPN: R-222-1P-1_16W-0201; MPN: ANY
U10M U11M = IS66WVE4M16: MPN: IS66WVE4M16EALL-70BLI; MYPN: U-IS66WVE4M16EALL-70BLI; VENDOR: ISSI
U12M = MX66UM1G45G: 1.8V 1Gbit x1/x8 OctaFlash SPINOR; MPN: MX66UM1G45GXDI00; VENDOR: Macronix; MYPN: U-MX66UM1G45GXDI00

## Sheet 03_power.SchDoc
size B
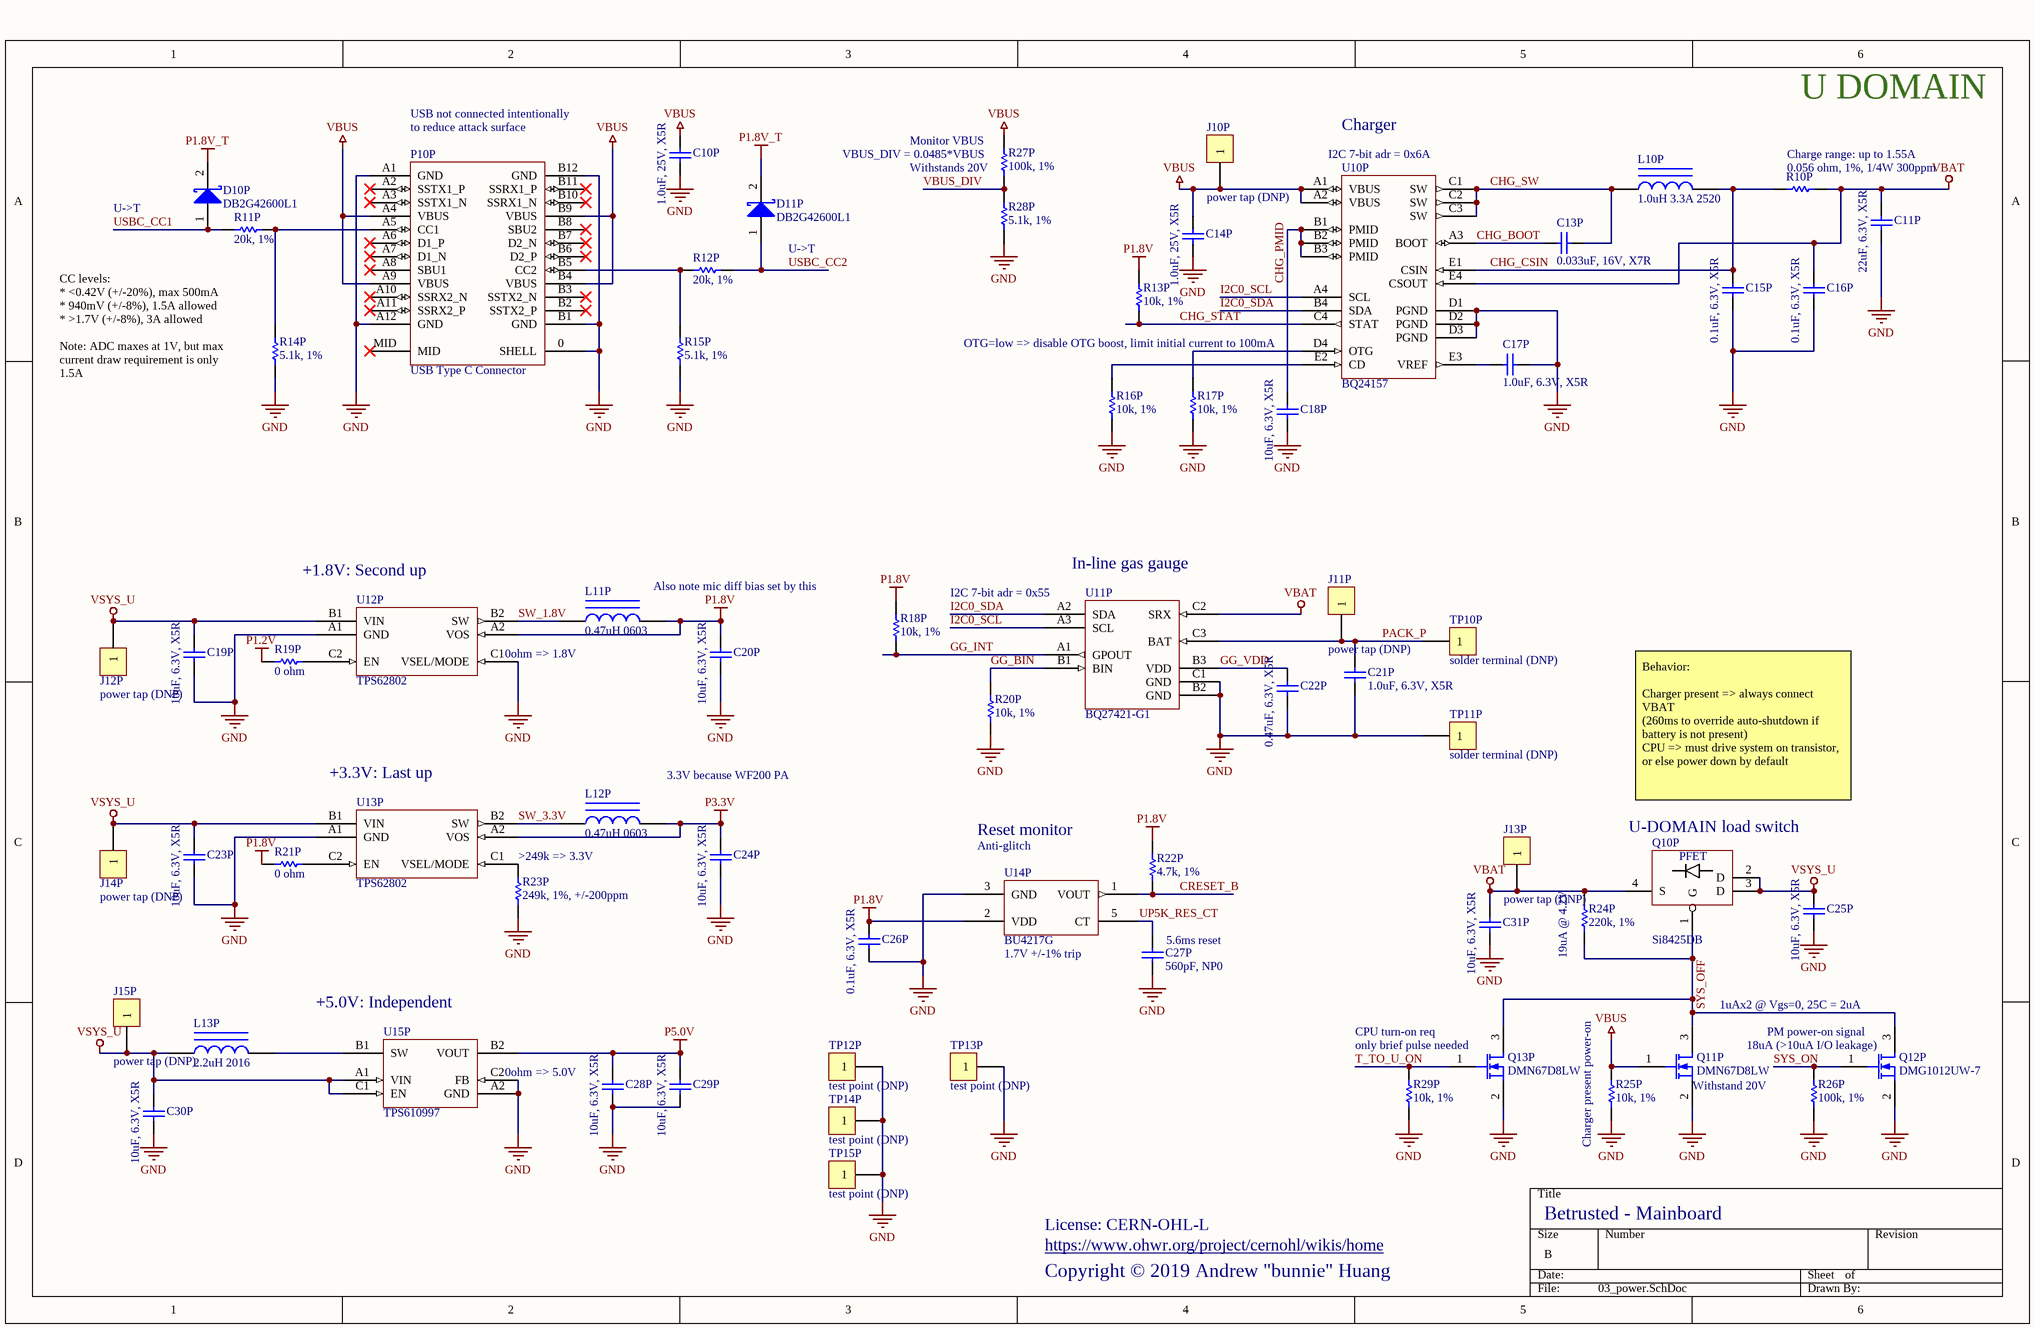
[diagram p4: 03_power.SchDoc]

### Parts
C10P  1.0uF, 25V, X5R  [B_CAP0603]
C11P  22uF, 6.3V, X5R  [B_CAP0805]
C13P  0.033uF, 16V, X7R  [B_RES0402]
C14P  1.0uF, 25V, X5R  [B_CAP0603]
C15P  0.1uF, 6.3V, X5R  [B_CAP0201]
C16P  0.1uF, 6.3V, X5R  [B_CAP0201]
C17P  1.0uF, 6.3V, X5R  [B_CAP0201]
C18P  10uF, 6.3V, X5R  [B_CAP0603]
C19P  10uF, 6.3V, X5R  [B_CAP0603]
C20P  10uF, 6.3V, X5R  [B_CAP0603]
C21P  1.0uF, 6.3V, X5R  [B_CAP0201]
C22P  0.47uF, 6.3V, X5R  [B_CAP0201]
C23P  10uF, 6.3V, X5R  [B_CAP0603]
C24P  10uF, 6.3V, X5R  [B_CAP0603]
C25P  10uF, 6.3V, X5R  [B_CAP0603]
C26P  0.1uF, 6.3V, X5R  [B_CAP0201]
C27P  560pF, NP0  [B_RES0201]
C28P  10uF, 6.3V, X5R  [B_CAP0603]
C29P  10uF, 6.3V, X5R  [B_CAP0603]
C30P  10uF, 6.3V, X5R  [B_CAP0603]
C31P  10uF, 6.3V, X5R  [B_CAP0603]
D10P  DB2G42600L1  [B_DIO0402]
D11P  DB2G42600L1  [B_DIO0402]
J10P  power tap (DNP)  [RESTAP-0603]
J11P  power tap (DNP)  [RESTAP-0603]
J12P  power tap (DNP)  [RESTAP-0603]
J13P  power tap (DNP)  [RESTAP-0603]
J14P  power tap (DNP)  [RESTAP-0603]
J15P  power tap (DNP)  [RESTAP-0603]
L10P  1.0uH 3.3A 2520  [B_IND2025_SAM]
L11P  0.47uH 0603  [B_IND0603]
L12P  0.47uH 0603  [B_IND0603]
L13P  2.2uH 2016  [B_IND2016_TDK]
P10P  USB Type C Connector  [HIROSE_CX90B1-24P]
Q10P  Si8425DB  [VISHAY_MICRO_FOOT_4_BUMP]
Q11P  DMN67D8LW  [SOT323-3AN]
Q12P  DMG1012UW-7  [SOT323-3AN]
Q13P  DMN67D8LW  [SOT323-3AN]
R10P  0.056 ohm, 1%, 1/4W 300ppm  [B_RES0402]
R11P  20k, 1%  [B_RES0201]
R12P  20k, 1%  [B_RES0201]
R13P  10k, 1%  [B_RES0201]
R14P  5.1k, 1%  [B_RES0201]
R15P  5.1k, 1%  [B_RES0201]
R16P  10k, 1%  [B_RES0201]
R17P  10k, 1%  [B_RES0201]
R18P  10k, 1%  [B_RES0201]
R19P  0 ohm  [B_RES0201]
R20P  10k, 1%  [B_RES0201]
R21P  0 ohm  [B_RES0201]
R22P  4.7k, 1%  [B_RES0201]
R23P  249k, 1%, +/-200ppm  [B_RES0402]
R24P  220k, 1%  [B_RES0201]
R25P  10k, 1%  [B_RES0201]
R26P  100k, 1%  [B_RES0201]
R27P  100k, 1%  [B_RES0201]
R28P  5.1k, 1%  [B_RES0201]
R29P  10k, 1%  [B_RES0201]
TP10P  solder terminal (DNP)  [55-MIL-HOLE]
TP11P  solder terminal (DNP)  [55-MIL-HOLE]
TP12P  test point (DNP)  [TP_2MM_SQ]
TP13P  test point (DNP)  [TP_2MM_SQ]
TP14P  test point (DNP)  [TP_2MM_SQ]
TP15P  test point (DNP)  [TP_2MM_SQ]
U10P  BQ24157  [BGA20C40P4X5_200X214X62]
U11P  BQ27421-G1  [BGA9C50P3X3_162X158X62]
U12P  TPS62802  [BGA6C35P2X3_70X105X40_NSMD]
U13P  TPS62802  [BGA6C35P2X3_70X105X40_NSMD]
U14P  BU4217G  [SOT23-5AN]
U15P  TPS610997  [BGA6C40P2X3_88X123X62]

### Nets
GND: C10P.2 C11P.2 C14P.2 C15P.2 C16P.2 C17P.2 C18P.2 C19P.2 C20P.2 C21P.1 C22P.2 C23P.2 C24P.2 C25P.2 C26P.2 C27P.2 C28P.2 C29P.2 C30P.2 C31P.2 P10P.0(SHELL) P10P.A1(GND) P10P.A12(GND) P10P.B1(GND) P10P.B12(GND) Q11P.2(S) Q12P.2(S) Q13P.2(S) R14P.2 R15P.2 R16P.2 R17P.2 R20P.2 R23P.2 R25P.2 R26P.1 R28P.2 R29P.2 TP11P.1 TP12P.1 TP13P.1 TP14P.1 TP15P.1 U10P.D1(PGND) U10P.D2(PGND) U10P.D3(PGND) U11P.B2(GND) U11P.C1(GND) U12P.A1(GND) U12P.C1(VSEL/MODE) U13P.A1(GND) U14P.3(GND) U15P.A2(GND) U15P.C2(FB)
P1.2V: R19P.1
P1.8V: C20P.1 C26P.1 L11P.2 R13P.1 R18P.1 R21P.1 R22P.2 U12P.A2(VOS) U14P.2(VDD)
P1.8V_T: D10P.2(K) D11P.2(K)
P3.3V: C24P.1 L12P.2 U13P.A2(VOS)
P5.0V: C28P.1 C29P.1 U15P.B2(VOUT)
PACK_P: C21P.2 J11P.1 TP10P.1 U11P.C3(BAT)
VBAT: C11P.1 C16P.1 C31P.1 J13P.1 Q10P.4(S) R10P.1 R24P.2 U10P.E4(CSOUT) U11P.C2(SRX)
VBUS: C10P.1 C14P.1 J10P.1 P10P.A4(VBUS) P10P.A9(VBUS) P10P.B4(VBUS) P10P.B9(VBUS) Q11P.1(G) R25P.1 R27P.2 U10P.A1(VBUS) U10P.A2(VBUS)
VSYS_U: C19P.1 C23P.1 C25P.1 C30P.1 J12P.1 J14P.1 J15P.1 L13P.1 Q10P.2(D) Q10P.3(D) U12P.B1(VIN) U13P.B1(VIN) U15P.A1(VIN) U15P.C1(EN)
CHG_BOOT: C13P.2 U10P.A3(BOOT)
CHG_CSIN: C15P.1 L10P.2 R10P.2 U10P.E1(CSIN)
CHG_PMID: C18P.1 U10P.B1(PMID) U10P.B2(PMID) U10P.B3(PMID)
CHG_STAT: R13P.2 U10P.C4(STAT)
CHG_SW: C13P.1 L10P.1 U10P.C1(SW) U10P.C2(SW) U10P.C3(SW)
CRESET_B: R22P.1 U14P.1(VOUT)
GG_BIN: R20P.1 U11P.B1(BIN)
GG_INT: R18P.2 U11P.A1(GPOUT)
GG_VDD: C22P.1 U11P.B3(VDD)
I2C0_SCL: U10P.A4(SCL) U11P.A3(SCL)
I2C0_SDA: U10P.B4(SDA) U11P.A2(SDA)
SW_1.8V: L11P.1 U12P.B2(SW)
SW_3.3V: L12P.1 U13P.B2(SW)
SYS_OFF: Q10P.1(G) Q11P.3(D) Q12P.3(D) Q13P.3(D) R24P.1
SYS_ON: Q12P.1(G) R26P.2
T_TO_U_ON: Q13P.1(G) R29P.1
UP5K_RES_CT: C27P.1 U14P.5(CT)
USBC_CC1: D10P.1(A) R11P.2
USBC_CC2: D11P.1(A) R12P.1
VBUS_DIV: R27P.1 R28P.1
NetC17P_1: C17P.1 U10P.E3(VREF)
NetL13P_2: L13P.2 U15P.B1(SW)
NetP10P_A5: P10P.A5(CC1) R11P.1 R14P.1
NetP10P_B5: P10P.B5(CC2) R12P.2 R15P.1
NetR16P_1: R16P.1 U10P.E2(CD)
NetR17P_1: R17P.1 U10P.D4(OTG)
NetR19P_2: R19P.2 U12P.C2(EN)
NetR21P_2: R21P.2 U13P.C2(EN)
NetR23P_1: R23P.1 U13P.C1(VSEL/MODE)

Not connected (* = marked no-connect by the designer): P10P A2(SSTX1_P)* A3(SSTX1_N)* A6(D1_P)* A7(D1_N)* A8(SBU1)* A10(SSRX2_N)* A11(SSRX2_P)* B2(SSTX2_P)* B3(SSTX2_N)* B6(D2_P)* B7(D2_N)* B8(SBU2)* B10(SSRX1_N)* B11(SSRX1_P)* MID*

### Notes on the sheet
- USB not connected intentionally
- (near P10P) to reduce attack surface
- Charger
- U DOMAIN
- (near R27P) VBUS_DIV = 0.0485*VBUS
- (near R27P) Monitor VBUS
- (near R27P) Withstands 20V
- (near U10P) I2C 7-bit adr = 0x6A
- (near R10P) Charge range: up to 1.55A
- U->T
- (near D11P) U->T
- CC levels:
  * <0.42V (+/-20%), max 500mA
  * 940mV (+/-8%), 1.5A allowed
  * >1.7V (+/-8%), 3A allowed
  Note: ADC maxes at 1V, but max current draw requirement is only 1.5A
- (near U10P) OTG=low => disable OTG boost, limit initial current to 100mA
- (near U12P) +1.8V: Second up
- Also note mic diff bias set by this
- (near U11P) I2C 7-bit adr = 0x55
- (near U11P) In-line gas gauge
- 0ohm => 1.8V
- (near U13P) +3.3V: Last up
- 3.3V because WF200 PA
- Behavior:
  Charger present => always connect VBAT
  (260ms to override auto-shutdown if battery is not present)
  CPU => must drive system on transistor, or else power down by default
- (near R23P) >249k => 3.3V
- Reset monitor
- (near U14P) Anti-glitch
- (near Q10P) U-DOMAIN load switch
- (near C27P) 5.6ms reset
- (near U15P) +5.0V: Independent
- (near U14P) 1.7V +/-1% trip
- (near R24P) 19uA @ 4.2V
- 1uAx2 @ Vgs=0, 25C = 2uA
- 0ohm => 5.0V
- CPU turn-on req
- (near Q13P) only brief pulse needed
- (near Q12P) 18uA (>10uA I/O leakage)
- (near Q12P) PM power-on signal
- (near R25P) Charger present power-on
- (near Q11P) Withstand 20V
- License: CERN-OHL-L
- Copyright © 2019 Andrew "bunnie" Huang
- https://www.ohwr.org/project/cernohl/wikis/home
- Betrusted - Mainboard
- (in symbol Si8425DB) PFET

### Library data of the parts
C10P C14P = Cap Semi: as C63F on sheet 01_fpga
C11P = Cap Semi: Capacitor (Semiconductor SIM Model); MPN: CL21A226MQQNNNE; VENDOR: Samsung; MYPN: C-226-6.3-X5R-0805
C13P = Cap Semi: Capacitor (Semiconductor SIM Model); MPN: CL05B333KO5NNNC; VENDOR: Samsung; MYPN: C-333-16-X7R-0402
C15P C16P C26P = Cap Semi: as C12F on sheet 01_fpga
C17P C21P = Cap Semi: as C22F on sheet 01_fpga
C18P C19P C20P C23P C24P C25P C28P C29P C30P C31P = Cap Semi: as C11F on sheet 01_fpga
C22P = Cap Semi: as C10F on sheet 01_fpga
C27P = Cap Semi: as C34F on sheet 01_fpga
D10P D11P = Diode 11DQ03: as D10M on sheet 02_memory; ComponentLink1Description: Manufacturer Link; ComponentLink1URL: http://www.irf.com/; ComponentLink2Description: Datasheet; ComponentLink2URL: http://www.irf.com/product-info/datasheets/data/11dq03.pdf; MPN: DB2G42600L1
J10P J11P J12P J13P J14P J15P = CON1: Connector; MYPN: J-TP-PWRTAP-0603; MPN: DNP; VENDOR: DNP
L10P = Inductor Iron: Magnetic-Core Inductor; MPN: CIGW252010GL1R0MNE; VENDOR: Samsung; MYPN: L-CIGW252010GL1R0MNE
L11P L12P = Inductor Iron: as L12F on sheet 01_fpga
L13P = Inductor Iron: Magnetic-Core Inductor; MPN: VLS201610CX-2R2M-1; VENDOR: TDK; MYPN: L-VLS201610CX-2R2M-1
P10P = USB_TYPE_C: MPN: CX90B1-24P; VENDOR: Hirose; MYPN: P-CX90B1-24P
Q10P = Si8425DB: as Q10F on sheet 01_fpga
Q11P Q13P = MOSFET-N: as Q12F on sheet 01_fpga; Published: 8-Jun-2000; LatestRevisionDate: 17-Jul-2002; LatestRevisionNote: Re-released for DXP Platform.; PackageVersion: 1995/1996; PackageReference: E3; Publisher: Altium Limited; MPN: DMN67D8LW
Q12P = MOSFET-N: as Q11F on sheet 01_fpga; Published: 8-Jun-2000; LatestRevisionDate: 17-Jul-2002; LatestRevisionNote: Re-released for DXP Platform.; PackageVersion: 1995/1996; PackageReference: E3; Publisher: Altium Limited; MPN: DMG1012UW-7
R10P = Res1: Resistor; MPN: ERJ-2BWFR056X; VENDOR: Panasonic; MYPN: R-0R56-1P-1_4W-0402
R11P R12P = Res1: Resistor; VENDOR: ANY; MYPN: R-203-1P-1_16W-0201; MPN: ANY
R13P R16P R17P R18P R20P R25P R29P = Res1: as R27F on sheet 01_fpga; MPN: ANY
R14P R15P R28P = Res1: Resistor; VENDOR: ANY; MYPN: R-512-1P-1_16W-0201; MPN: ANY
R19P R21P = Res1: as R12F on sheet 01_fpga; MPN: ANY
R22P = Res1: as R15F on sheet 01_fpga; MPN: ANY
R23P = Res1: Resistor; MPN: RC0402FR-07249KL; VENDOR: Yageo; MYPN: R-2493-1P-1_16W-0402
R24P = Res1: as R10F on sheet 01_fpga; MPN: ANY
R26P R27P = Res1: as R14F on sheet 01_fpga; MPN: ANY
TP10P TP11P TP12P TP13P TP14P TP15P = CON1: Connector; MYPN: Built into PCB; MPN: DNP; VENDOR: DNP
U10P = BQ24157: Fully integrated switch-mode charger with USB compliance and OTG support; MPN: BQ24157YFFR; VENDOR: TI; MYPN: U-BQ24157YFF(R/T)
U11P = BQ27421-G1: System-Side Impedance Track Fuel Gauge with integrated Sense Resistor; MPN: bq27421YZFT-G1A; VENDOR: TI; MYPN: bq27421YZF(T/R)-G1A
U12P U13P = TPS62802: as U13F on sheet 01_fpga
U14P = BU42XXG: as U14F on sheet 01_fpga
U15P = TPS610997: Synchronous Boost Converter with Ultra-Low Iq; MPN: TPS610997YFFR; VENDOR: TI; MYPN: TPS610997YFFT(T/R)

## Sheet 04_io.SchDoc
size B
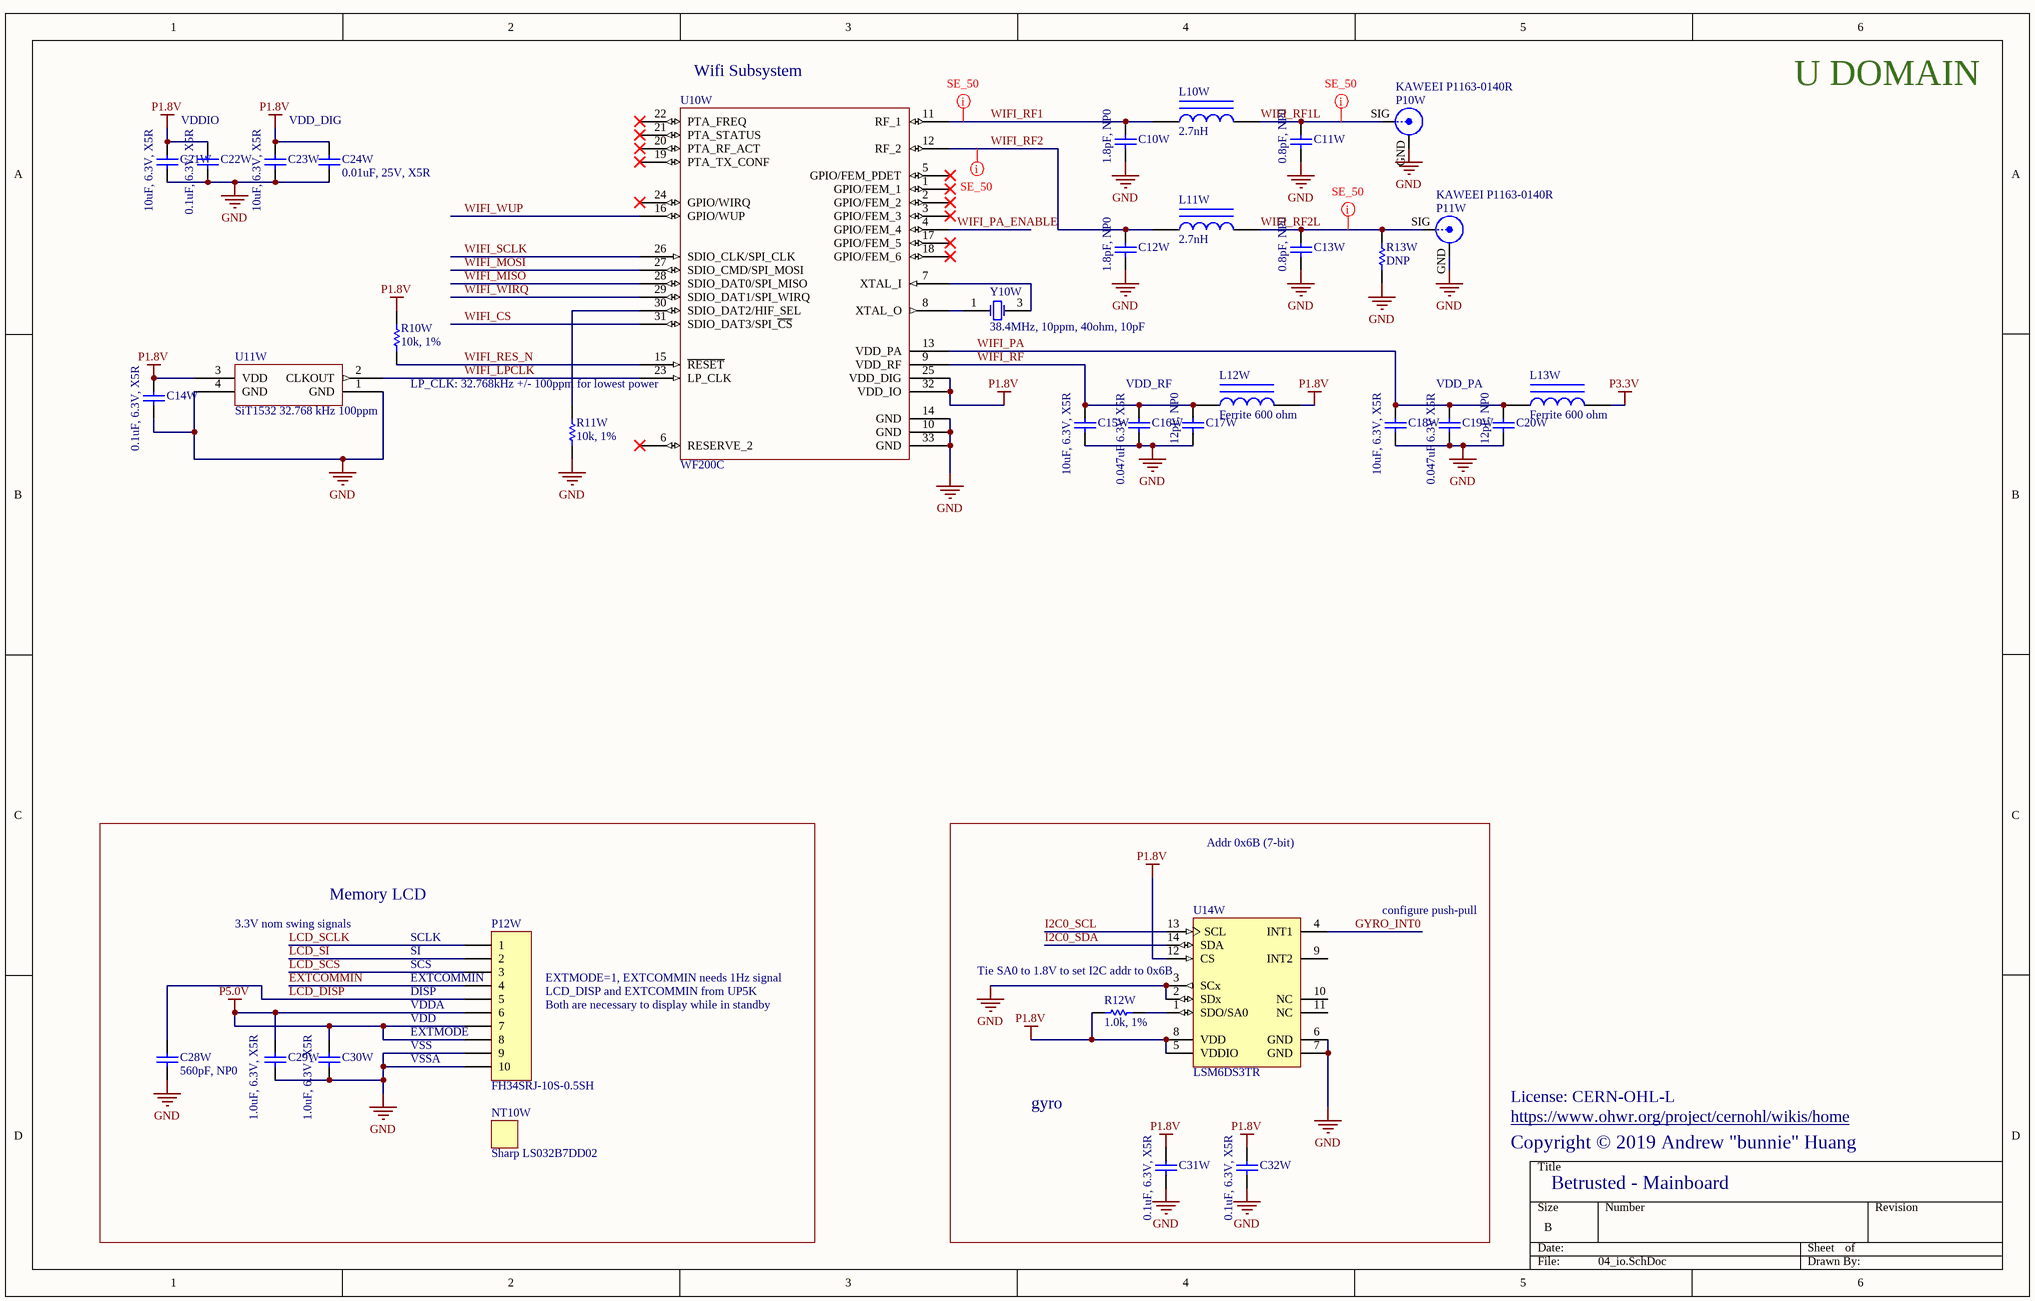
[diagram p5: 04_io.SchDoc]

### Parts
C10W  1.8pF, NP0  [B_CAP0201]
C11W  0.8pF, NP0  [B_CAP0201]
C12W  1.8pF, NP0  [B_CAP0201]
C13W  0.8pF, NP0  [B_CAP0201]
C14W  0.1uF, 6.3V, X5R  [B_CAP0201]
C15W  10uF, 6.3V, X5R  [B_CAP0603]
C16W  0.047uF 6.3V X5R  [B_CAP0201]
C17W  12pF, NP0  [B_CAP0201]
C18W  10uF, 6.3V, X5R  [B_CAP0603]
C19W  0.047uF 6.3V X5R  [B_CAP0201]
C20W  12pF, NP0  [B_CAP0201]
C21W  10uF, 6.3V, X5R  [B_CAP0603]
C22W  0.1uF, 6.3V, X5R  [B_CAP0201]
C23W  10uF, 6.3V, X5R  [B_CAP0603]
C24W  0.01uF, 25V, X5R  [B_RES0201]
C28W  560pF, NP0  [B_RES0201]
C29W  1.0uF, 6.3V, X5R  [B_CAP0201]
C30W  1.0uF, 6.3V, X5R  [B_CAP0201]
C31W  0.1uF, 6.3V, X5R  [B_CAP0201]
C32W  0.1uF, 6.3V, X5R  [B_CAP0201]
L10W  2.7nH  [B_IND0402]
L11W  2.7nH  [B_IND0402]
L12W  Ferrite 600 ohm  [B_IND0603]
L13W  Ferrite 600 ohm  [B_IND0603]
NT10W  Sharp LS032B7DD02
P10W  KAWEEI P1163-0140R  [HRS_U.FL]
P11W  KAWEEI P1163-0140R  [HRS_U.FL]
P12W  FH34SRJ-10S-0.5SH  [HRS_FH34SRJ-10S-0.5SH(50)]
R10W  10k, 1%  [B_RES0201]
R11W  10k, 1%  [B_RES0201]
R12W  1.0k, 1%  [B_RES0201]
R13W  DNP  [B_RES0201]
U10W  WF200C  [QFN40P400X400X90_HS-33N]
U11W  SiT1532 32.768 kHz 100ppm  [SiTIME_CSP]
U14W  LSM6DS3TR  [LGA-14_2500X3000X860_N]
Y10W  38.4MHz, 10ppm, 40ohm, 10pF  [XOSC_3.2_2.5]

### Blocks framed on the sheet
Memory LCD: C28W C29W C30W NT10W P12W
gyro: C31W C32W R12W U14W

### Nets
GND: C10W.2 C11W.2 C12W.2 C13W.2 C14W.2 C15W.2 C16W.2 C17W.2 C18W.2 C19W.2 C20W.2 C21W.2 C22W.2 C23W.2 C24W.2 C28W.2 C29W.1 C30W.1 C31W.2 C32W.2 P10W.GND(Y) P11W.GND(Y) P12W.9 P12W.10 R11W.2 R13W.2 U10W.10(GND) U10W.14(GND) U10W.33(GND) U11W.1(GND) U11W.4(GND) U14W.2(SDx) U14W.3(SCx) U14W.6(GND) U14W.7(GND)
P1.8V: C14W.1 C21W.1 C22W.1 C23W.1 C24W.1 C31W.1 C32W.1 L12W.2 R10W.1 R12W.2 U10W.25(VDD_DIG) U10W.32(VDD_IO) U11W.3(VDD) U14W.5(VDDIO) U14W.8(VDD) U14W.12(CS)
P3.3V: L13W.2
P5.0V: C29W.2 C30W.2 P12W.6 P12W.7 P12W.8
EXTCOMMIN: P12W.4
GYRO_INT0: U14W.4(INT1)
I2C0_SCL: U14W.13(SCL)
I2C0_SDA: U14W.14(SDA)
LCD_DISP: C28W.1 P12W.5
LCD_SCLK: P12W.1
LCD_SCS: P12W.3
LCD_SI: P12W.2
WIFI_CS: U10W.31(SDIO_DAT3/SPI_~{CS})
WIFI_LPCLK: U10W.23(LP_CLK) U11W.2(CLKOUT)
WIFI_MISO: U10W.28(SDIO_DAT0/SPI_MISO)
WIFI_MOSI: U10W.27(SDIO_CMD/SPI_MOSI)
WIFI_PA: C18W.1 C19W.1 C20W.1 L13W.1 U10W.13(VDD_PA)
WIFI_PA_ENABLE: U10W.4(GPIO/FEM_4)
WIFI_RES_N: R10W.2 U10W.15(~{RESET})
WIFI_RF: C15W.1 C16W.1 C17W.1 L12W.1 U10W.9(VDD_RF)
WIFI_RF1: C10W.1 L10W.1 U10W.11(RF_1)
WIFI_RF1L: C11W.1 L10W.2 P10W.SIG(X)
WIFI_RF2: C12W.1 L11W.1 U10W.12(RF_2)
WIFI_RF2L: C13W.1 L11W.2 P11W.SIG(X) R13W.1
WIFI_SCLK: U10W.26(SDIO_CLK/SPI_CLK)
WIFI_WIRQ: U10W.29(SDIO_DAT1/SPI_WIRQ)
WIFI_WUP: U10W.16(GPIO/WUP)
NetR11W_1: R11W.1 U10W.30(SDIO_DAT2/HIF_SEL)
NetR12W_1: R12W.1 U14W.1(SDO/SA0)
NetU10W_7: U10W.7(XTAL_I) Y10W.3(OSC2)
NetU10W_8: U10W.8(XTAL_O) Y10W.1(OSC1)

Not connected (* = marked no-connect by the designer): U10W 1(GPIO/FEM_1)* 2(GPIO/FEM_2)* 3(GPIO/FEM_3)* 5(GPIO/FEM_PDET)* 6(RESERVE_2)* 17(GPIO/FEM_5)* 18(GPIO/FEM_6)* 19(PTA_TX_CONF)* 20(PTA_RF_ACT)* 21(PTA_STATUS)* 22(PTA_FREQ)* 24(GPIO/WIRQ)*; U14W 9(INT2) 10(NC) 11(NC)

### Layout directives
net class SE_50: WIFI_RF1, WIFI_RF1L, WIFI_RF2, WIFI_RF2L

### Notes on the sheet
- (near U10W) Wifi Subsystem
- U DOMAIN
- VDDIO
- VDD_DIG
- (near U10W) LP_CLK: 32.768kHz +/- 100ppm for lowest power
- VDD_RF
- VDD_PA
- Addr 0x6B (7-bit)
- configure push-pull
- 3.3V nom swing signals
- SCLK
- SI
- SCS
- (near P12W) EXTCOMMIN
- EXTMODE=1, EXTCOMMIN needs 1Hz signal
- (near U14W) Tie SA0 to 1.8V to set I2C addr to 0x6B
- DISP
- VDDA
- VDD
- (near P12W) EXTMODE
- VSS
- LCD_DISP and EXTCOMMIN from UP5K
- Both are necessary to display while in standby
- VSSA
- License: CERN-OHL-L
- Copyright © 2019 Andrew "bunnie" Huang
- https://www.ohwr.org/project/cernohl/wikis/home
- Betrusted - Mainboard

### Library data of the parts
C10W C12W = Cap Semi: Capacitor (Semiconductor SIM Model); MPN: GRM0335C1H1R8BA01D; VENDOR: Murata; MYPN: C-1R8-50-NP0-0201
C11W C13W = Cap Semi: Capacitor (Semiconductor SIM Model); MPN: GRM0335C1ER80BA01D; VENDOR: Murata; MYPN: C-0R8-25-NP0-0201
C14W C22W C31W C32W = Cap Semi: as C12F on sheet 01_fpga
C15W C18W C21W C23W = Cap Semi: as C11F on sheet 01_fpga
C16W C19W = Cap Semi: Capacitor (Semiconductor SIM Model); MPN: CL03A473KQ3NNNC; VENDOR: Murata; MYPN: C-473-6P3-X5R-0201
C17W C20W = Cap Semi: Capacitor (Semiconductor SIM Model); MPN: GRM0335C1E120JA01D; VENDOR: Murata; MYPN: C-120-25-NP0-0201
C24W = Cap Semi: as C35F on sheet 01_fpga
C28W = Cap Semi: as C34F on sheet 01_fpga
C29W C30W = Cap Semi: as C22F on sheet 01_fpga
L10W L11W = Inductor Iron: Magnetic-Core Inductor; MPN: LQW15AN2N7C00; VENDOR: Murata; MYPN: L-LQW15AN2N7C00
L12W L13W = Inductor Iron: as L10F on sheet 01_fpga
NT10W = NOTE: Placeholder for non-board BOM items; MYPN: NT-LCD-LS032B7DD02; MPN: LS032B7DD02; VENDOR: Sharp
P10W P11W = BNC: BNC Elbow Connector; MYPN: U.FL-R-SMT-1(10); LatestRevisionDate: 17-Jul-2002; LatestRevisionNote: Re-released for DXP Platform.; Publisher: Altium Limited; MPN: P1163-0140R; VENDOR: Kaweei
P12W = Header 10: Header, 10-Pin; VENDOR: Hirose; MYPN: J-FH34SRJ-10S-0.5SH(50/99); LatestRevisionDate: 17-Jul-2002; LatestRevisionNote: Re-released for DXP Platform.; Publisher: Altium Limited; MPN: FH34SRJ-10S-0.5SH
R10W R11W = Res1: as R27F on sheet 01_fpga; MPN: ANY
R12W = Res1: as R17F on sheet 01_fpga; MPN: ANY
R13W = Res1: Resistor; VENDOR: DNP; MYPN: DNP; MPN: DNP
U10W = WF200C(R): Wifi Network Coprocessor; VENDOR: SiLabs; MYPN: U-WF200C(R); MPN: WF200C
U11W = SiT1532: 10ppm ultra low power 32.768 kHz replacement; MPN: SIT1532AI-J4-DCC-32.768E; VENDOR: SiTime; MYPN: U-SIT1532AX-JX-DCC-32.768X
U14W = LSM6DS3TR: iNEMO Inertial Module: Always-on 3D Accelerometer and 3D Gyroscope, 1.71 to 3.6 V, -40 to 85 degC, 14-Pin LGA, RoHS, Tape and Reel; Sensing Distance: 2|4|6|8|16G; Number of Axis: 3; VENDOR: STMicroelectronics; Output Type: Digital; Lead Finish: GoldOverNickel; Max Processing Temp: 260; Screening Level: Industrial; Typical Supply Current: 1.25Milliamps; Operating Supply Voltage: 1.8volt; MYPN: U-LSM6DS3TR; Type: AccelerometerandGyroscope; Datasheet Version: Rev. 8, 02/2016; Datasheet URL: http://www2.st.com/content/ccc/resource/technical/document/datasheet/a3/f5/4f/ae/8e/44/41/d7/DM00133076.pdf/files/DM00133076.pdf/jcr:content/translations/en.DM00133076.pdf; Mounting: SurfaceMount; Manufacturer URL: http://www.st.com/; Operating Temperature: -40to85C; MPN: LSM6DS3TR
Y10W = XTAL: Crystal Oscillator; MPN: ECS-384-10-33B-CKY-TR; VENDOR: ECS; MYPN: X-38.4000-40OHM-10PF-10PPM; Published: 8-Jun-2000; LatestRevisionDate: 17-Jul-2002; LatestRevisionNote: Re-released for DXP Platform.; PackageReference: R38; Publisher: Altium Limited; PackageDescription: Crystal, Thru-Hole; 2 Leads; Body 3.1 x 8.2 mm (Dia.xH)